# EAGLE schematic module_special_reg_ctrl (EAGLE 6.5.0)

## Sheet 1 of 12
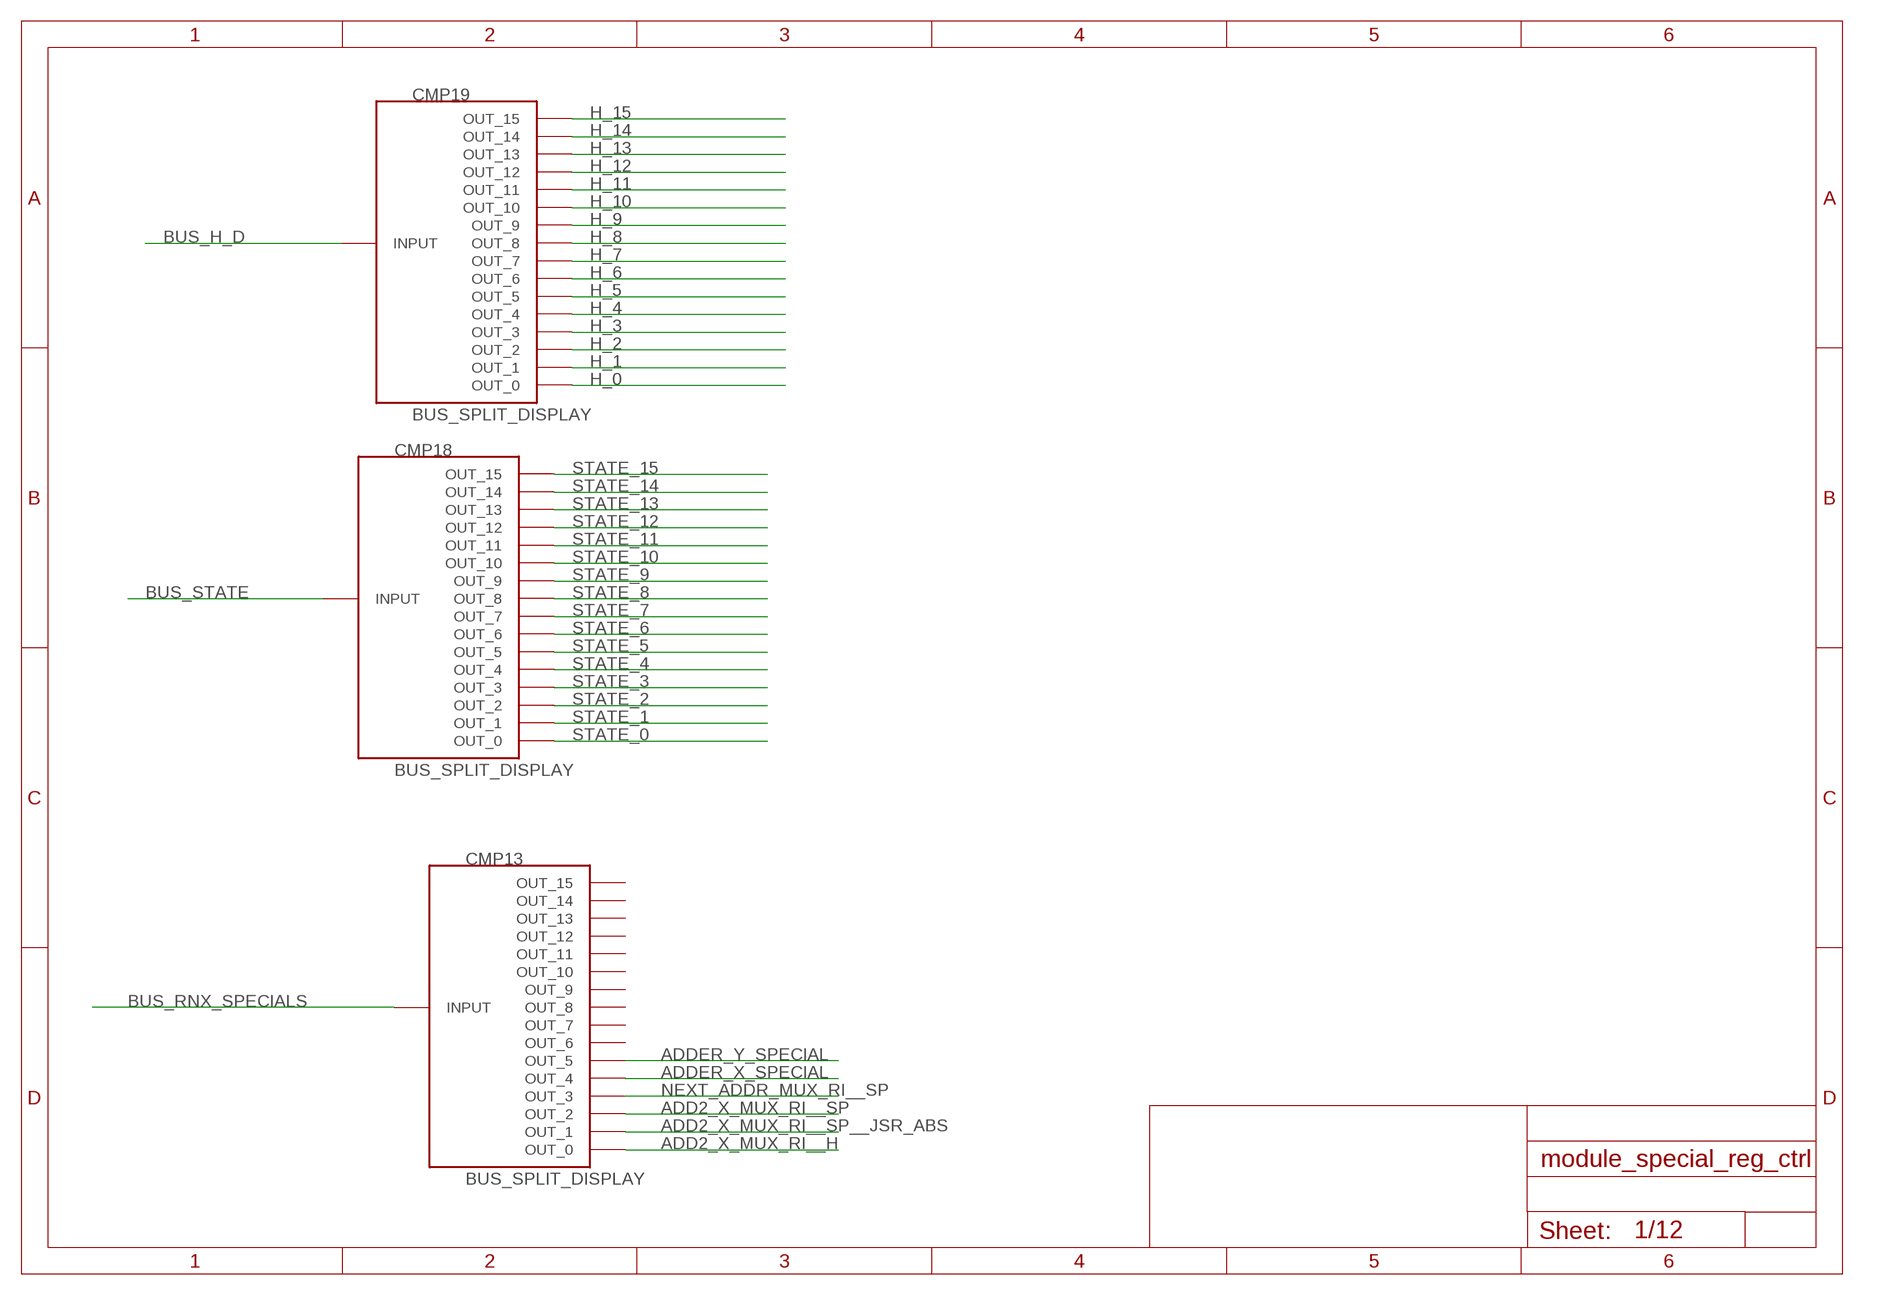
[diagram p0: schematic, sheet 1]

### Parts
CMP13  BUS_SPLIT_DISPLAY  [BUS_SPLIT_DISPLAY]
CMP18  BUS_SPLIT_DISPLAY  [BUS_SPLIT_DISPLAY]
CMP19  BUS_SPLIT_DISPLAY  [BUS_SPLIT_DISPLAY]

### Nets
ADD2_X_MUX_RI__H: CMP13.P$1(OUT_0)
ADD2_X_MUX_RI__SP: CMP13.P$3(OUT_2)
ADD2_X_MUX_RI__SP__JSR_ABS: CMP13.P$2(OUT_1) ; also sheet 9
ADDER_X_SPECIAL: CMP13.P$5(OUT_4)
ADDER_Y_SPECIAL: CMP13.P$6(OUT_5)
BUS_H_D: CMP19.INPUT
BUS_RNX_SPECIALS: CMP13.INPUT
BUS_STATE: CMP18.INPUT
H_0: CMP19.P$1(OUT_0) ; also sheet 4
H_1: CMP19.P$2(OUT_1) ; also sheet 4
H_2: CMP19.P$3(OUT_2) ; also sheet 4
H_3: CMP19.P$4(OUT_3) ; also sheet 4
H_4: CMP19.P$5(OUT_4) ; also sheet 7
H_5: CMP19.P$6(OUT_5) ; also sheet 6
H_6: CMP19.P$7(OUT_6)
H_7: CMP19.P$8(OUT_7)
H_8: CMP19.P$9(OUT_8)
H_9: CMP19.P$10(OUT_9)
H_10: CMP19.P$11(OUT_10)
H_11: CMP19.P$12(OUT_11)
H_12: CMP19.P$13(OUT_12)
H_13: CMP19.P$14(OUT_13)
H_14: CMP19.P$15(OUT_14)
H_15: CMP19.P$16(OUT_15)
NEXT_ADDR_MUX_RI__SP: CMP13.P$4(OUT_3) ; also sheet 10
STATE_0: CMP18.P$1(OUT_0) ; also sheet 4,5,6,7,8,9,10,11,12
STATE_1: CMP18.P$2(OUT_1) ; also sheet 4,5,6,8,9
STATE_2: CMP18.P$3(OUT_2) ; also sheet 4,6,7
STATE_3: CMP18.P$4(OUT_3)
STATE_4: CMP18.P$5(OUT_4) ; also sheet 4,5
STATE_5: CMP18.P$6(OUT_5) ; also sheet 8
STATE_6: CMP18.P$7(OUT_6) ; also sheet 4,9,11,12
STATE_7: CMP18.P$8(OUT_7) ; also sheet 4,12
STATE_8: CMP18.P$9(OUT_8) ; also sheet 7
STATE_9: CMP18.P$10(OUT_9) ; also sheet 12
STATE_10: CMP18.P$11(OUT_10) ; also sheet 6
STATE_11: CMP18.P$12(OUT_11) ; also sheet 6
STATE_12: CMP18.P$13(OUT_12) ; also sheet 6
STATE_13: CMP18.P$14(OUT_13) ; also sheet 5,6
STATE_14: CMP18.P$15(OUT_14)
STATE_15: CMP18.P$16(OUT_15) ; also sheet 7,9,12
Unconnected: CMP13.P$7(OUT_6) CMP13.P$8(OUT_7) CMP13.P$9(OUT_8) CMP13.P$10(OUT_9) CMP13.P$11(OUT_10) CMP13.P$12(OUT_11) CMP13.P$13(OUT_12) CMP13.P$14(OUT_13) CMP13.P$15(OUT_14) CMP13.P$16(OUT_15)

## Sheet 2 of 12
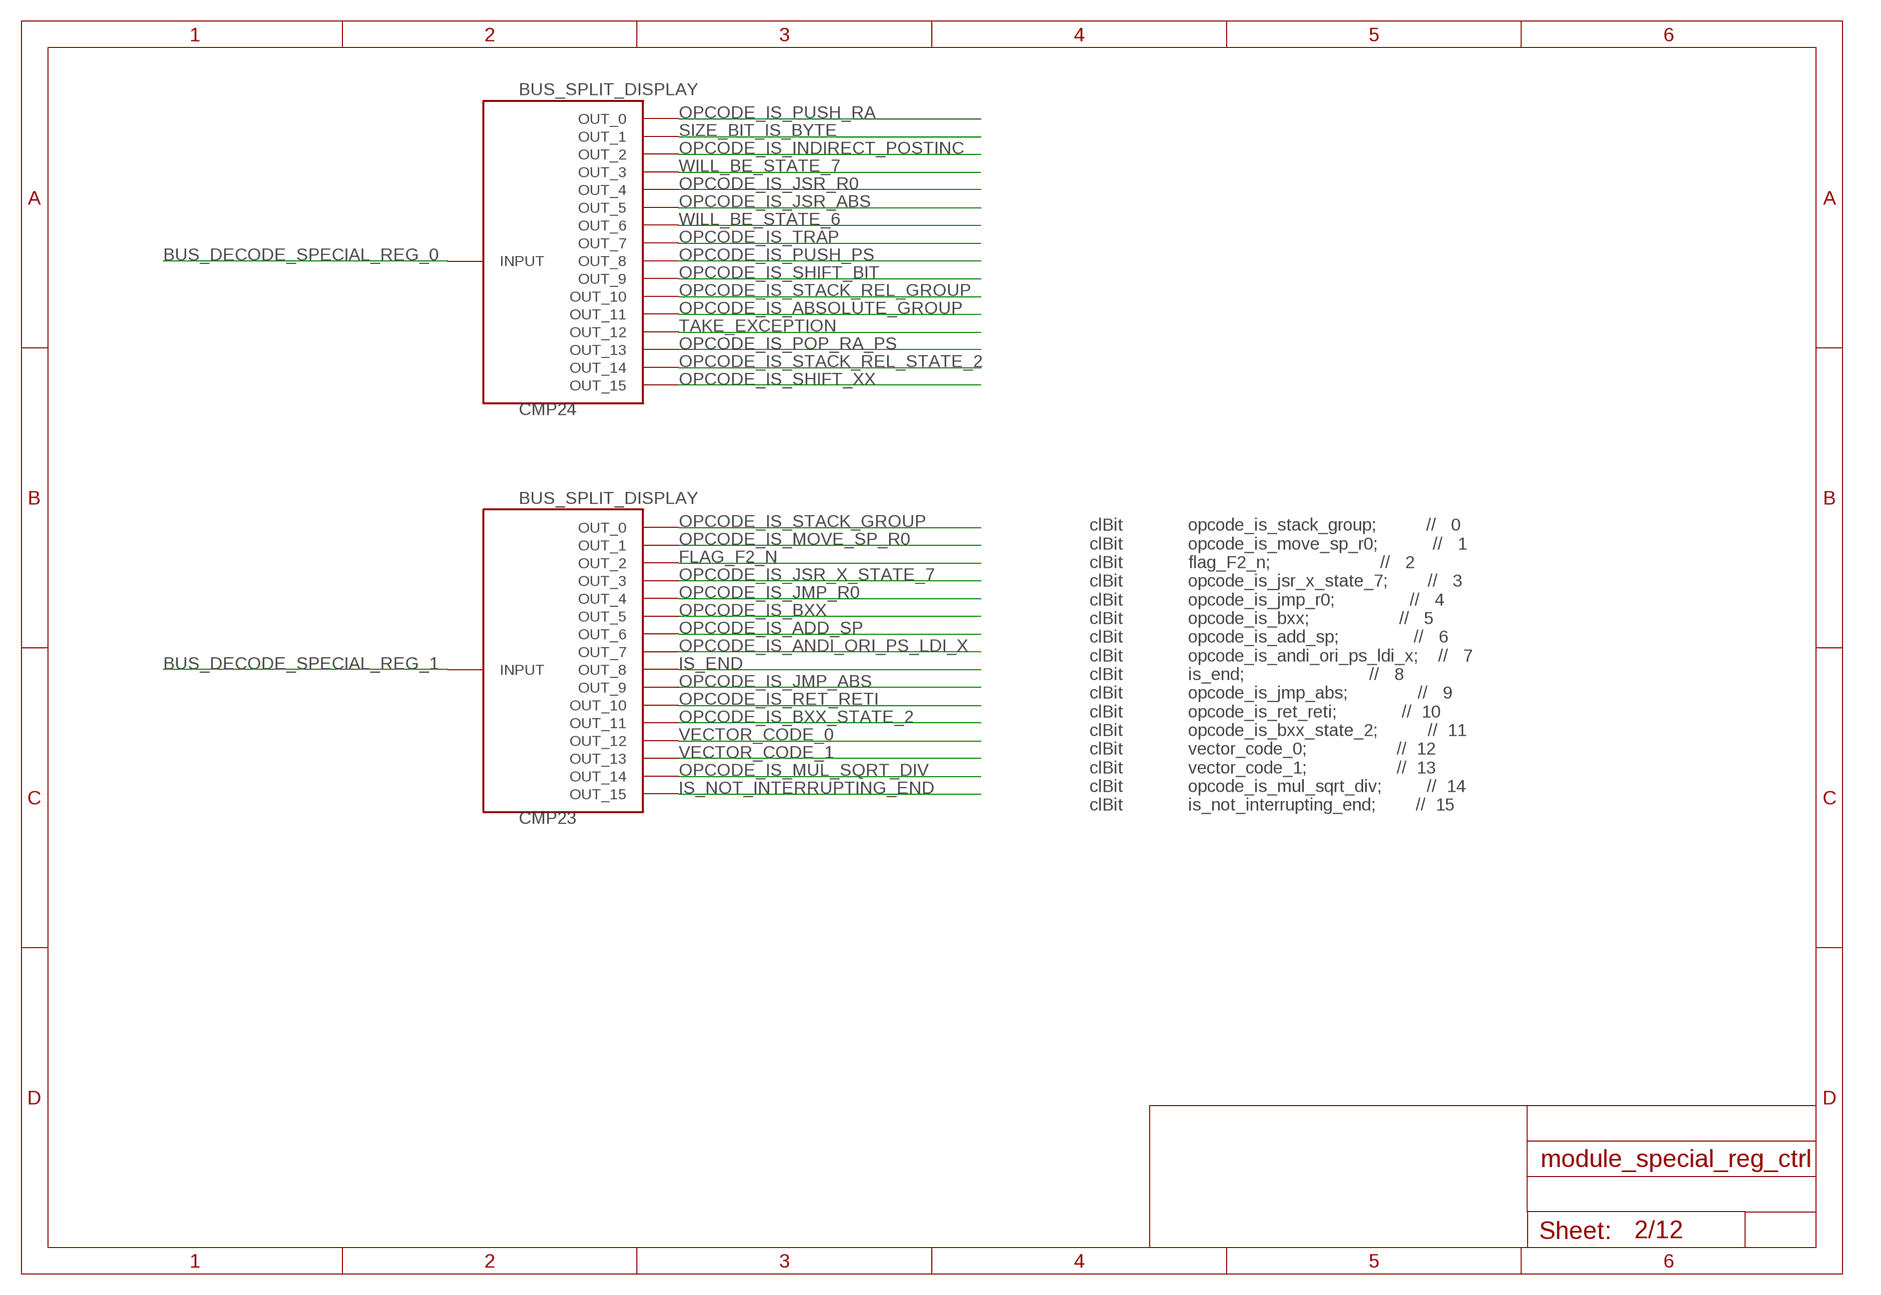
[diagram p1: schematic, sheet 2]

### Parts
CMP23  BUS_SPLIT_DISPLAY  [BUS_SPLIT_DISPLAY]
CMP24  BUS_SPLIT_DISPLAY  [BUS_SPLIT_DISPLAY]

### Nets
BUS_DECODE_SPECIAL_REG_0: CMP24.INPUT
BUS_DECODE_SPECIAL_REG_1: CMP23.INPUT
FLAG_F2_N: CMP23.P$3(OUT_2) ; also sheet 9
IS_END: CMP23.P$9(OUT_8) ; also sheet 9,10
IS_NOT_INTERRUPTING_END: CMP23.P$16(OUT_15) ; also sheet 8
OPCODE_IS_ABSOLUTE_GROUP: CMP24.P$12(OUT_11) ; also sheet 5,8,9
OPCODE_IS_ADD_SP: CMP23.P$7(OUT_6) ; also sheet 7,8
OPCODE_IS_ANDI_ORI_PS_LDI_X: CMP23.P$8(OUT_7) ; also sheet 8
OPCODE_IS_BXX: CMP23.P$6(OUT_5) ; also sheet 8
OPCODE_IS_BXX_STATE_2: CMP23.P$12(OUT_11) ; also sheet 8,9
OPCODE_IS_INDIRECT_POSTINC: CMP24.P$3(OUT_2) ; also sheet 5,6,10
OPCODE_IS_JMP_ABS: CMP23.P$10(OUT_9) ; also sheet 8
OPCODE_IS_JMP_R0: CMP23.P$5(OUT_4) ; also sheet 8
OPCODE_IS_JSR_ABS: CMP24.P$6(OUT_5) ; also sheet 5,8,11
OPCODE_IS_JSR_R0: CMP24.P$5(OUT_4) ; also sheet 7,9,11
OPCODE_IS_JSR_X_STATE_7: CMP23.P$4(OUT_3) ; also sheet 8
OPCODE_IS_MOVE_SP_R0: CMP23.P$2(OUT_1) ; also sheet 7
OPCODE_IS_MUL_SQRT_DIV: CMP23.P$15(OUT_14) ; also sheet 5,6
OPCODE_IS_POP_RA_PS: CMP24.P$14(OUT_13) ; also sheet 7,10
OPCODE_IS_PUSH_PS: CMP24.P$9(OUT_8) ; also sheet 7,9,10,11
OPCODE_IS_PUSH_RA: CMP24.P$1(OUT_0) ; also sheet 7,9,10,11,12
OPCODE_IS_RET_RETI: CMP23.P$11(OUT_10) ; also sheet 5,7,8
OPCODE_IS_SHIFT_BIT: CMP24.P$10(OUT_9) ; also sheet 6,8
OPCODE_IS_SHIFT_XX: CMP24.P$16(OUT_15) ; also sheet 4,6
OPCODE_IS_STACK_GROUP: CMP23.P$1(OUT_0) ; also sheet 7
OPCODE_IS_STACK_REL_GROUP: CMP24.P$11(OUT_10) ; also sheet 4,5,8,9,10
OPCODE_IS_STACK_REL_STATE_2: CMP24.P$15(OUT_14) ; also sheet 10
OPCODE_IS_TRAP: CMP24.P$8(OUT_7) ; also sheet 4,9,11
SIZE_BIT_IS_BYTE: CMP24.P$2(OUT_1) ; also sheet 11,12
TAKE_EXCEPTION: CMP24.P$13(OUT_12) ; also sheet 3,10
VECTOR_CODE_0: CMP23.P$13(OUT_12) ; also sheet 3
VECTOR_CODE_1: CMP23.P$14(OUT_13) ; also sheet 3
WILL_BE_STATE_6: CMP24.P$7(OUT_6) ; also sheet 11
WILL_BE_STATE_7: CMP24.P$4(OUT_3) ; also sheet 11,12

### Notes on the sheet
- clBit             opcode_is_stack_group;          //   0
      clBit             opcode_is_move_sp_r0;           //   1
      clBit             flag_F2_n;                      //   2
      clBit             opcode_is_jsr_x_state_7;        //   3
      clBit             opcode_is_jmp_r0;               //   4
      clBit             opcode_is_bxx;                  //   5
      clBit             opcode_is_add_sp;               //   6
      clBit             opcode_is_andi_ori_ps_ldi_x;    //   7
      clBit             is_end;                         //   8
      clBit             opcode_is_jmp_abs;              //   9
      clBit             opcode_is_ret_reti;             //  10
      clBit             opcode_is_bxx_state_2;          //  11
      clBit             vector_code_0;                  //  12
      clBit             vector_code_1;                  //  13
      clBit             opcode_is_mul_sqrt_div;         //  14
      clBit             is_not_interrupting_end;        //  15

## Sheet 3 of 12
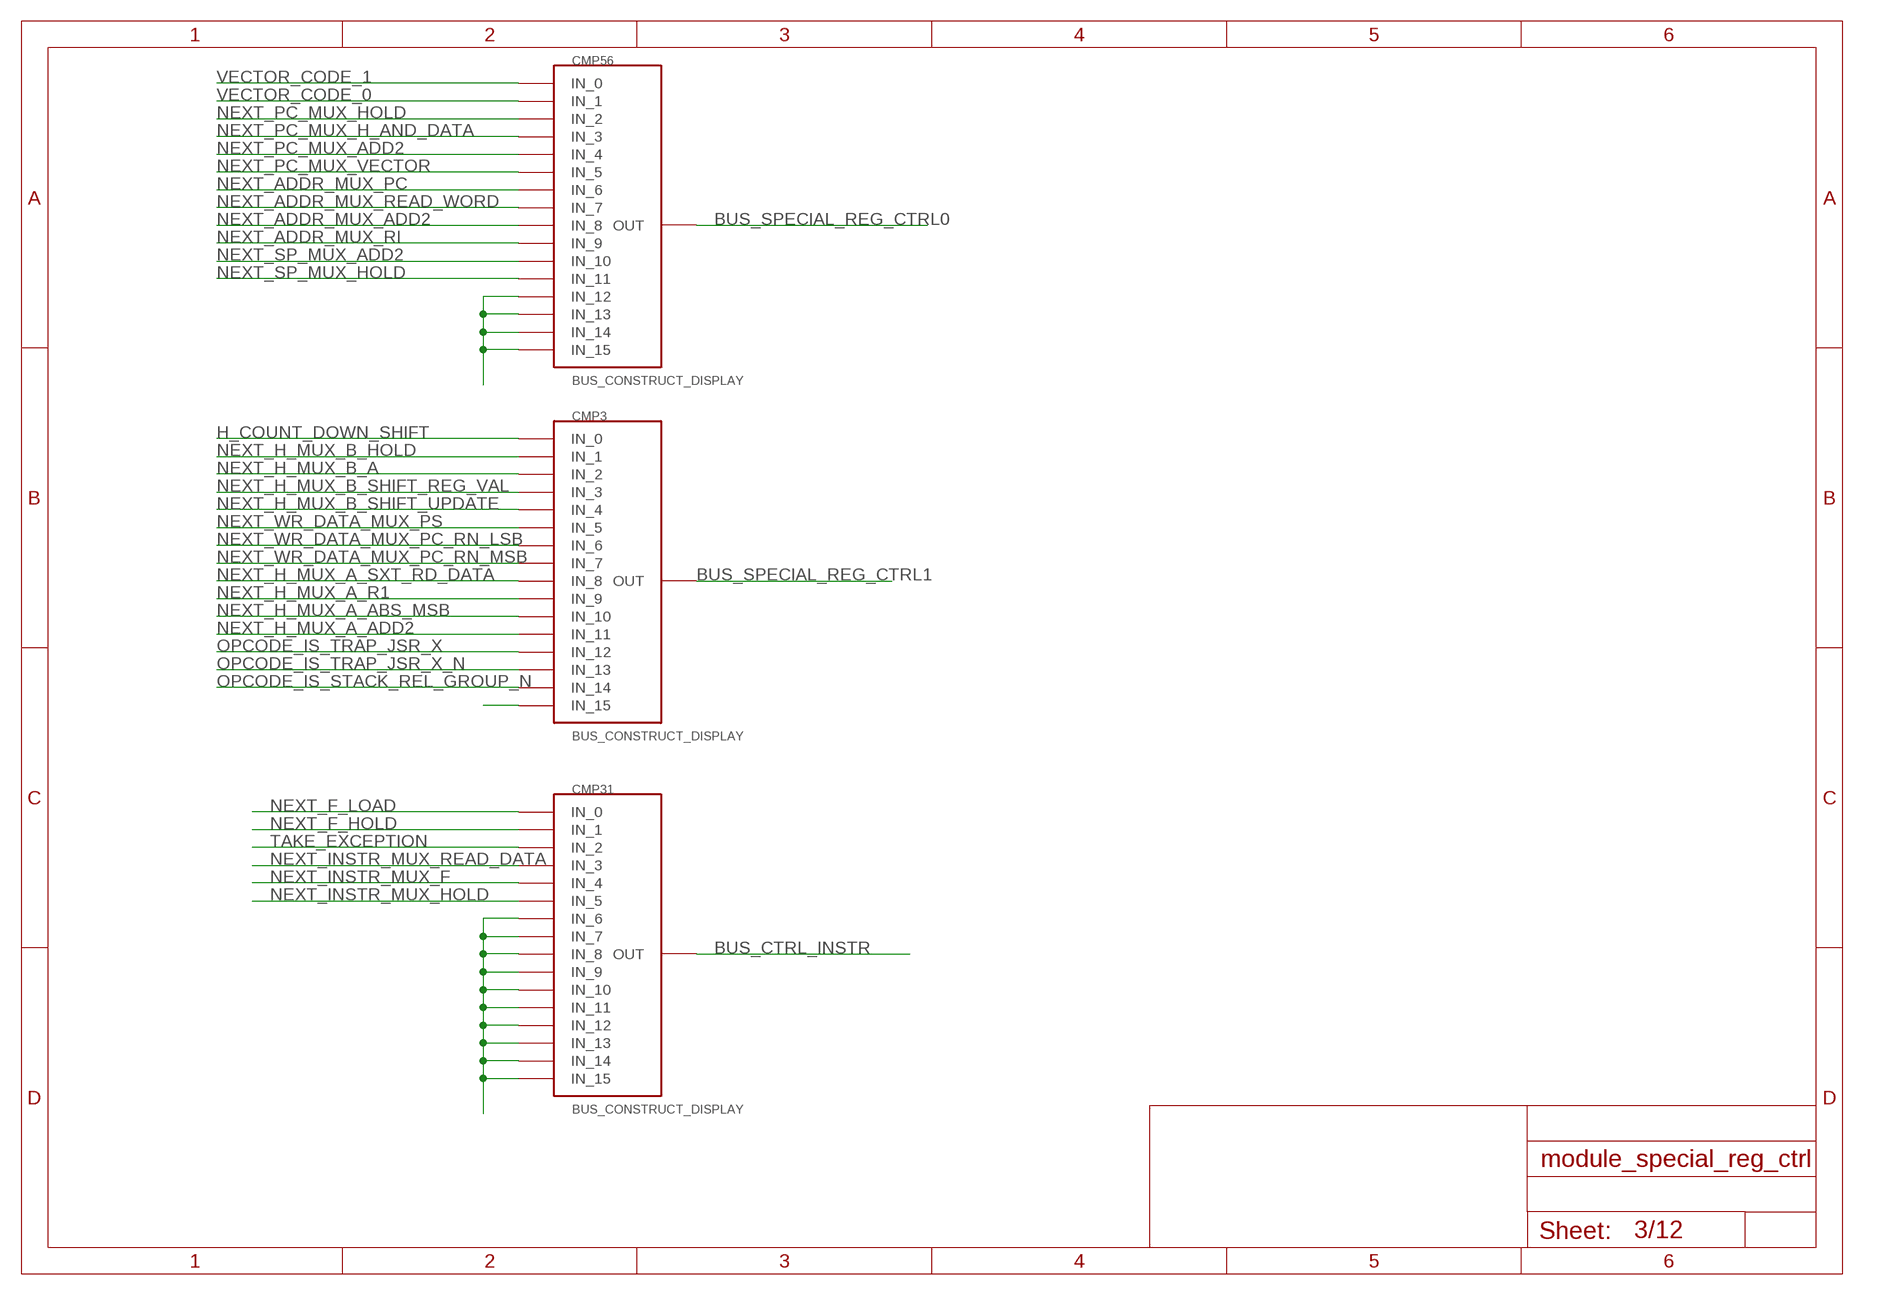
[diagram p2: schematic, sheet 3]

### Parts
CMP3  BUS_CONSTRUCT_DISPLAY  [BUS_SPLIT_DISPLAY]
CMP31  BUS_CONSTRUCT_DISPLAY  [BUS_SPLIT_DISPLAY]
CMP56  BUS_CONSTRUCT_DISPLAY  [BUS_SPLIT_DISPLAY]

### Nets
BUS_CTRL_INSTR: CMP31.INPUT(OUT)
BUS_SPECIAL_REG_CTRL0: CMP56.INPUT(OUT)
BUS_SPECIAL_REG_CTRL1: CMP3.INPUT(OUT)
H_COUNT_DOWN_SHIFT: CMP3.P$1(IN_0) ; also sheet 4
N$1: CMP56.P$13(IN_12) CMP56.P$14(IN_13) CMP56.P$15(IN_14) CMP56.P$16(IN_15)
N$3: CMP3.P$16(IN_15)
N$4: CMP31.P$7(IN_6) CMP31.P$8(IN_7) CMP31.P$9(IN_8) CMP31.P$10(IN_9) CMP31.P$11(IN_10) CMP31.P$12(IN_11) CMP31.P$13(IN_12) CMP31.P$14(IN_13) CMP31.P$15(IN_14) CMP31.P$16(IN_15)
NEXT_ADDR_MUX_ADD2: CMP56.P$9(IN_8) ; also sheet 9,10
NEXT_ADDR_MUX_PC: CMP56.P$7(IN_6) ; also sheet 10
NEXT_ADDR_MUX_READ_WORD: CMP56.P$8(IN_7) ; also sheet 9,10
NEXT_ADDR_MUX_RI: CMP56.P$10(IN_9) ; also sheet 10
NEXT_F_HOLD: CMP31.P$2(IN_1) ; also sheet 10
NEXT_F_LOAD: CMP31.P$1(IN_0) ; also sheet 10
NEXT_H_MUX_A_ABS_MSB: CMP3.P$11(IN_10) ; also sheet 5,6
NEXT_H_MUX_A_ADD2: CMP3.P$12(IN_11) ; also sheet 6
NEXT_H_MUX_A_R1: CMP3.P$10(IN_9) ; also sheet 5,6
NEXT_H_MUX_A_SXT_RD_DATA: CMP3.P$9(IN_8) ; also sheet 5,6
NEXT_H_MUX_B_A: CMP3.P$3(IN_2) ; also sheet 6,7
NEXT_H_MUX_B_HOLD: CMP3.P$2(IN_1) ; also sheet 7
NEXT_H_MUX_B_SHIFT_REG_VAL: CMP3.P$4(IN_3) ; also sheet 6,7
NEXT_H_MUX_B_SHIFT_UPDATE: CMP3.P$5(IN_4) ; also sheet 6,7
NEXT_INSTR_MUX_F: CMP31.P$5(IN_4) ; also sheet 10
NEXT_INSTR_MUX_HOLD: CMP31.P$6(IN_5) ; also sheet 10
NEXT_INSTR_MUX_READ_DATA: CMP31.P$4(IN_3) ; also sheet 10
NEXT_PC_MUX_ADD2: CMP56.P$5(IN_4) ; also sheet 8
NEXT_PC_MUX_H_AND_DATA: CMP56.P$4(IN_3) ; also sheet 8
NEXT_PC_MUX_HOLD: CMP56.P$3(IN_2) ; also sheet 8
NEXT_PC_MUX_VECTOR: CMP56.P$6(IN_5) ; also sheet 8
NEXT_SP_MUX_ADD2: CMP56.P$11(IN_10) ; also sheet 7
NEXT_SP_MUX_HOLD: CMP56.P$12(IN_11) ; also sheet 7
NEXT_WR_DATA_MUX_PC_RN_LSB: CMP3.P$7(IN_6) ; also sheet 11
NEXT_WR_DATA_MUX_PC_RN_MSB: CMP3.P$8(IN_7) ; also sheet 12
NEXT_WR_DATA_MUX_PS: CMP3.P$6(IN_5) ; also sheet 11,12
OPCODE_IS_STACK_REL_GROUP_N: CMP3.P$15(IN_14) ; also sheet 4
OPCODE_IS_TRAP_JSR_X: CMP3.P$13(IN_12) ; also sheet 11,12
OPCODE_IS_TRAP_JSR_X_N: CMP3.P$14(IN_13) ; also sheet 11
TAKE_EXCEPTION: CMP31.P$3(IN_2) ; also sheet 2,10
VECTOR_CODE_0: CMP56.P$2(IN_1) ; also sheet 2
VECTOR_CODE_1: CMP56.P$1(IN_0) ; also sheet 2

## Sheet 4 of 12
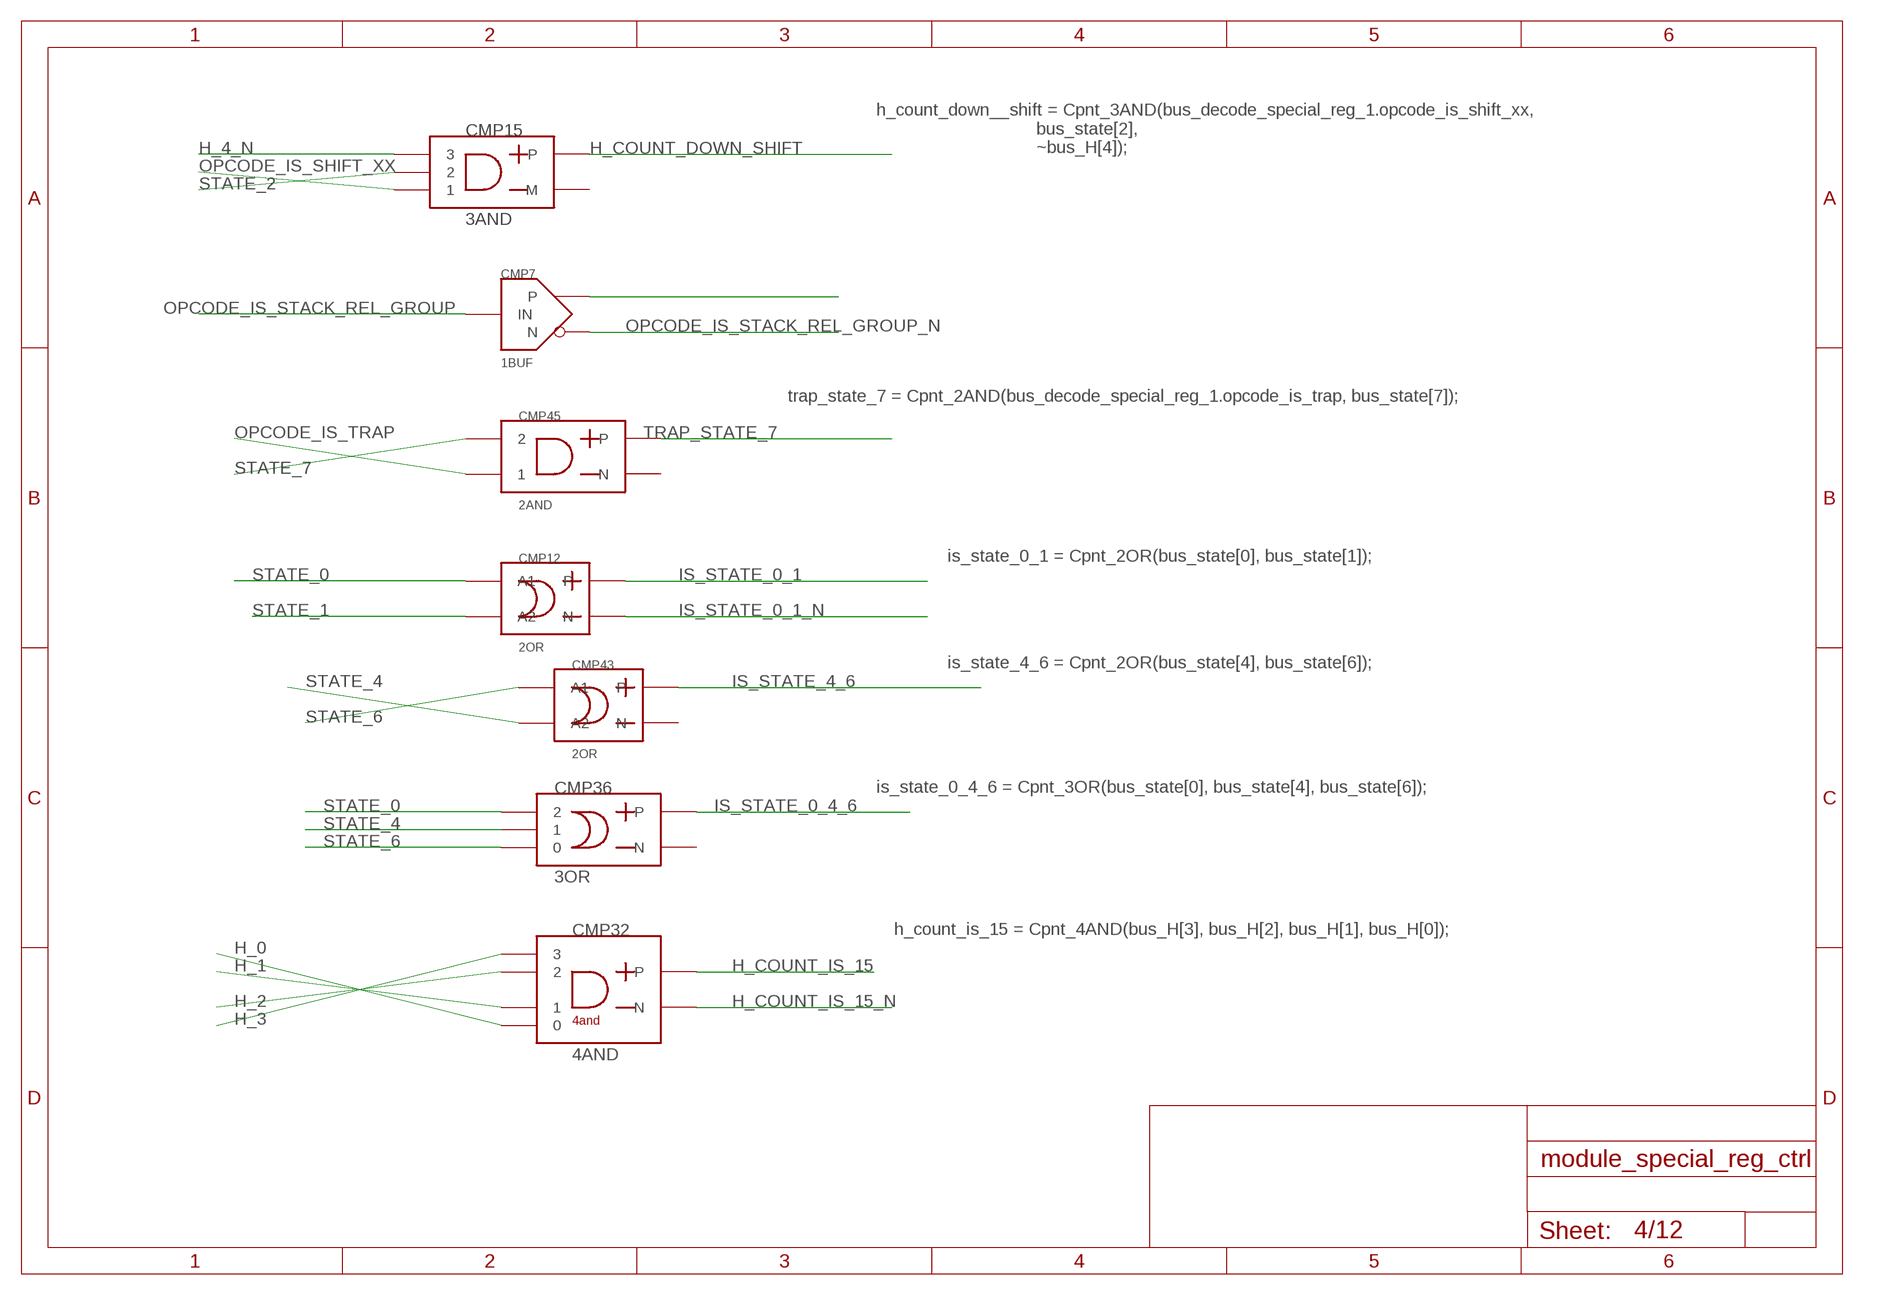
[diagram p3: schematic, sheet 4]

### Parts
CMP7  1BUF  [1BUF]
CMP12  2OR  [2OR]
CMP15  3AND  [3AND]
CMP32  4AND  [4AND]
CMP36  3OR  [3OR]
CMP43  2OR  [2OR]
CMP45  2AND  [2AND]

### Nets
H_0: CMP32.P$1 ; also sheet 1
H_1: CMP32.P$2 ; also sheet 1
H_2: CMP32.P$3 ; also sheet 1
H_3: CMP32.P$4 ; also sheet 1
H_4_N: CMP15.P$3 ; also sheet 7
H_COUNT_DOWN_SHIFT: CMP15.OUT_P(P) ; also sheet 3
H_COUNT_IS_15: CMP32.OUT_P(P) ; also sheet 5
H_COUNT_IS_15_N: CMP32.OUT_M(N) ; also sheet 6
IS_STATE_0_1: CMP12.OUT_P(P) ; also sheet 8
IS_STATE_0_1_N: CMP12.OUT_M(N) ; also sheet 5
IS_STATE_0_4_6: CMP36.OUT_P(P) ; also sheet 10
IS_STATE_4_6: CMP43.OUT_P(P) ; also sheet 7,9
N$8: CMP7.P
OPCODE_IS_SHIFT_XX: CMP15.P$1 ; also sheet 2,6
OPCODE_IS_STACK_REL_GROUP: CMP7.IN ; also sheet 2,5,8,9,10
OPCODE_IS_STACK_REL_GROUP_N: CMP7.N ; also sheet 3
OPCODE_IS_TRAP: CMP45.P$1 ; also sheet 2,9,11
STATE_0: CMP12.P$2(A1) CMP36.P$3 ; also sheet 1,5,6,7,8,9,10,11,12
STATE_1: CMP12.P$1(A2) ; also sheet 1,5,6,8,9
STATE_2: CMP15.P$2 ; also sheet 1,6,7
STATE_4: CMP36.P$2 CMP43.P$1(A2) ; also sheet 1,5
STATE_6: CMP36.P$1 CMP43.P$2(A1) ; also sheet 1,9,11,12
STATE_7: CMP45.P$2 ; also sheet 1,12
TRAP_STATE_7: CMP45.OUT_P(P) ; also sheet 7,8,9,11
Unconnected: CMP15.OUT_M(M) CMP36.OUT_M(N) CMP43.OUT_M(N) CMP45.OUT_M(N)

### Notes on the sheet
- h_count_down__shift = Cpnt_3AND(bus_decode_special_reg_1.opcode_is_shift_xx,
                                      bus_state[2],
                                      ~bus_H[4]);
- trap_state_7 = Cpnt_2AND(bus_decode_special_reg_1.opcode_is_trap, bus_state[7]);
- is_state_0_1 = Cpnt_2OR(bus_state[0], bus_state[1]);
- is_state_4_6 = Cpnt_2OR(bus_state[4], bus_state[6]);
- is_state_0_4_6 = Cpnt_3OR(bus_state[0], bus_state[4], bus_state[6]);
- h_count_is_15 = Cpnt_4AND(bus_H[3], bus_H[2], bus_H[1], bus_H[0]);

## Sheet 5 of 12
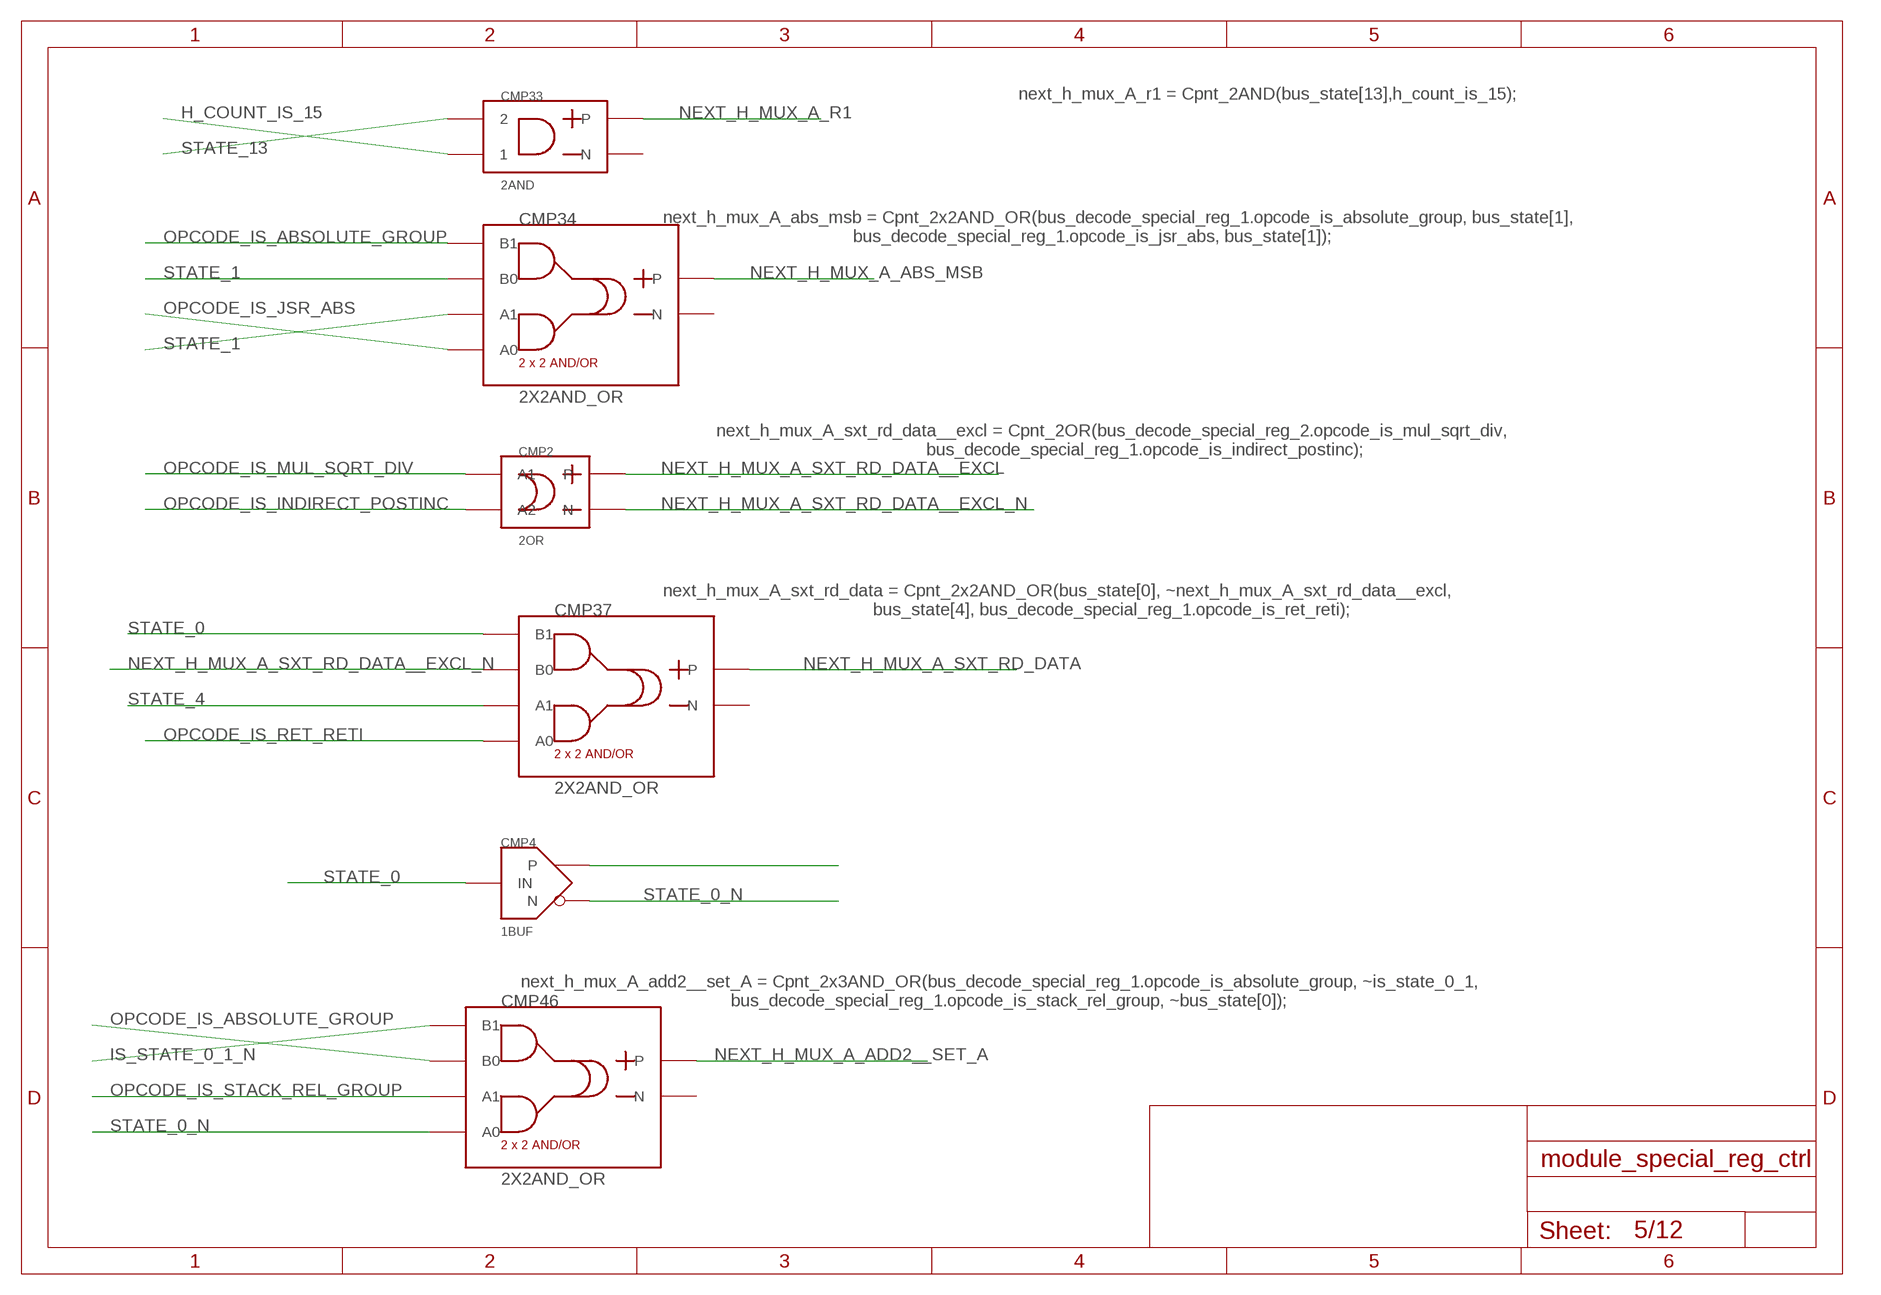
[diagram p4: schematic, sheet 5]

### Parts
CMP2  2OR  [2OR]
CMP4  1BUF  [1BUF]
CMP33  2AND  [2AND]
CMP34  2X2AND_OR  [2X2AND_OR]
CMP37  2X2AND_OR  [2X2AND_OR]
CMP46  2X2AND_OR  [2X2AND_OR]

### Nets
H_COUNT_IS_15: CMP33.P$1 ; also sheet 4
IS_STATE_0_1_N: CMP46.P$4(B1) ; also sheet 4
N$2: CMP4.P
NEXT_H_MUX_A_ABS_MSB: CMP34.OUT_P(P) ; also sheet 3,6
NEXT_H_MUX_A_ADD2__SET_A: CMP46.OUT_P(P) ; also sheet 6
NEXT_H_MUX_A_R1: CMP33.OUT_P(P) ; also sheet 3,6
NEXT_H_MUX_A_SXT_RD_DATA: CMP37.OUT_P(P) ; also sheet 3,6
NEXT_H_MUX_A_SXT_RD_DATA__EXCL: CMP2.OUT_P(P)
NEXT_H_MUX_A_SXT_RD_DATA__EXCL_N: CMP2.OUT_M(N) CMP37.P$3(B0)
OPCODE_IS_ABSOLUTE_GROUP: CMP34.P$4(B1) CMP46.P$3(B0) ; also sheet 2,8,9
OPCODE_IS_INDIRECT_POSTINC: CMP2.P$1(A2) ; also sheet 2,6,10
OPCODE_IS_JSR_ABS: CMP34.P$1(A0) ; also sheet 2,8,11
OPCODE_IS_MUL_SQRT_DIV: CMP2.P$2(A1) ; also sheet 2,6
OPCODE_IS_RET_RETI: CMP37.P$1(A0) ; also sheet 2,7,8
OPCODE_IS_STACK_REL_GROUP: CMP46.P$2(A1) ; also sheet 2,4,8,9,10
STATE_0: CMP4.IN CMP37.P$4(B1) ; also sheet 1,4,6,7,8,9,10,11,12
STATE_0_N: CMP4.N CMP46.P$1(A0)
STATE_1: CMP34.P$2(A1) CMP34.P$3(B0) ; also sheet 1,4,6,8,9
STATE_4: CMP37.P$2(A1) ; also sheet 1,4
STATE_13: CMP33.P$2 ; also sheet 1,6
Unconnected: CMP33.OUT_M(N) CMP34.OUT_M(N) CMP37.OUT_M(N) CMP46.OUT_M(N)

### Notes on the sheet
- next_h_mux_A_r1 = Cpnt_2AND(bus_state[13],h_count_is_15);
- next_h_mux_A_abs_msb = Cpnt_2x2AND_OR(bus_decode_special_reg_1.opcode_is_absolute_group, bus_state[1],
                                            bus_decode_special_reg_1.opcode_is_jsr_abs, bus_state[1]);
- next_h_mux_A_sxt_rd_data__excl = Cpnt_2OR(bus_decode_special_reg_2.opcode_is_mul_sqrt_div,
                                                bus_decode_special_reg_1.opcode_is_indirect_postinc);
- next_h_mux_A_sxt_rd_data = Cpnt_2x2AND_OR(bus_state[0], ~next_h_mux_A_sxt_rd_data__excl,
                                                bus_state[4], bus_decode_special_reg_1.opcode_is_ret_reti);
- next_h_mux_A_add2__set_A = Cpnt_2x3AND_OR(bus_decode_special_reg_1.opcode_is_absolute_group, ~is_state_0_1,
                                                bus_decode_special_reg_1.opcode_is_stack_rel_group, ~bus_state[0]);

## Sheet 6 of 12
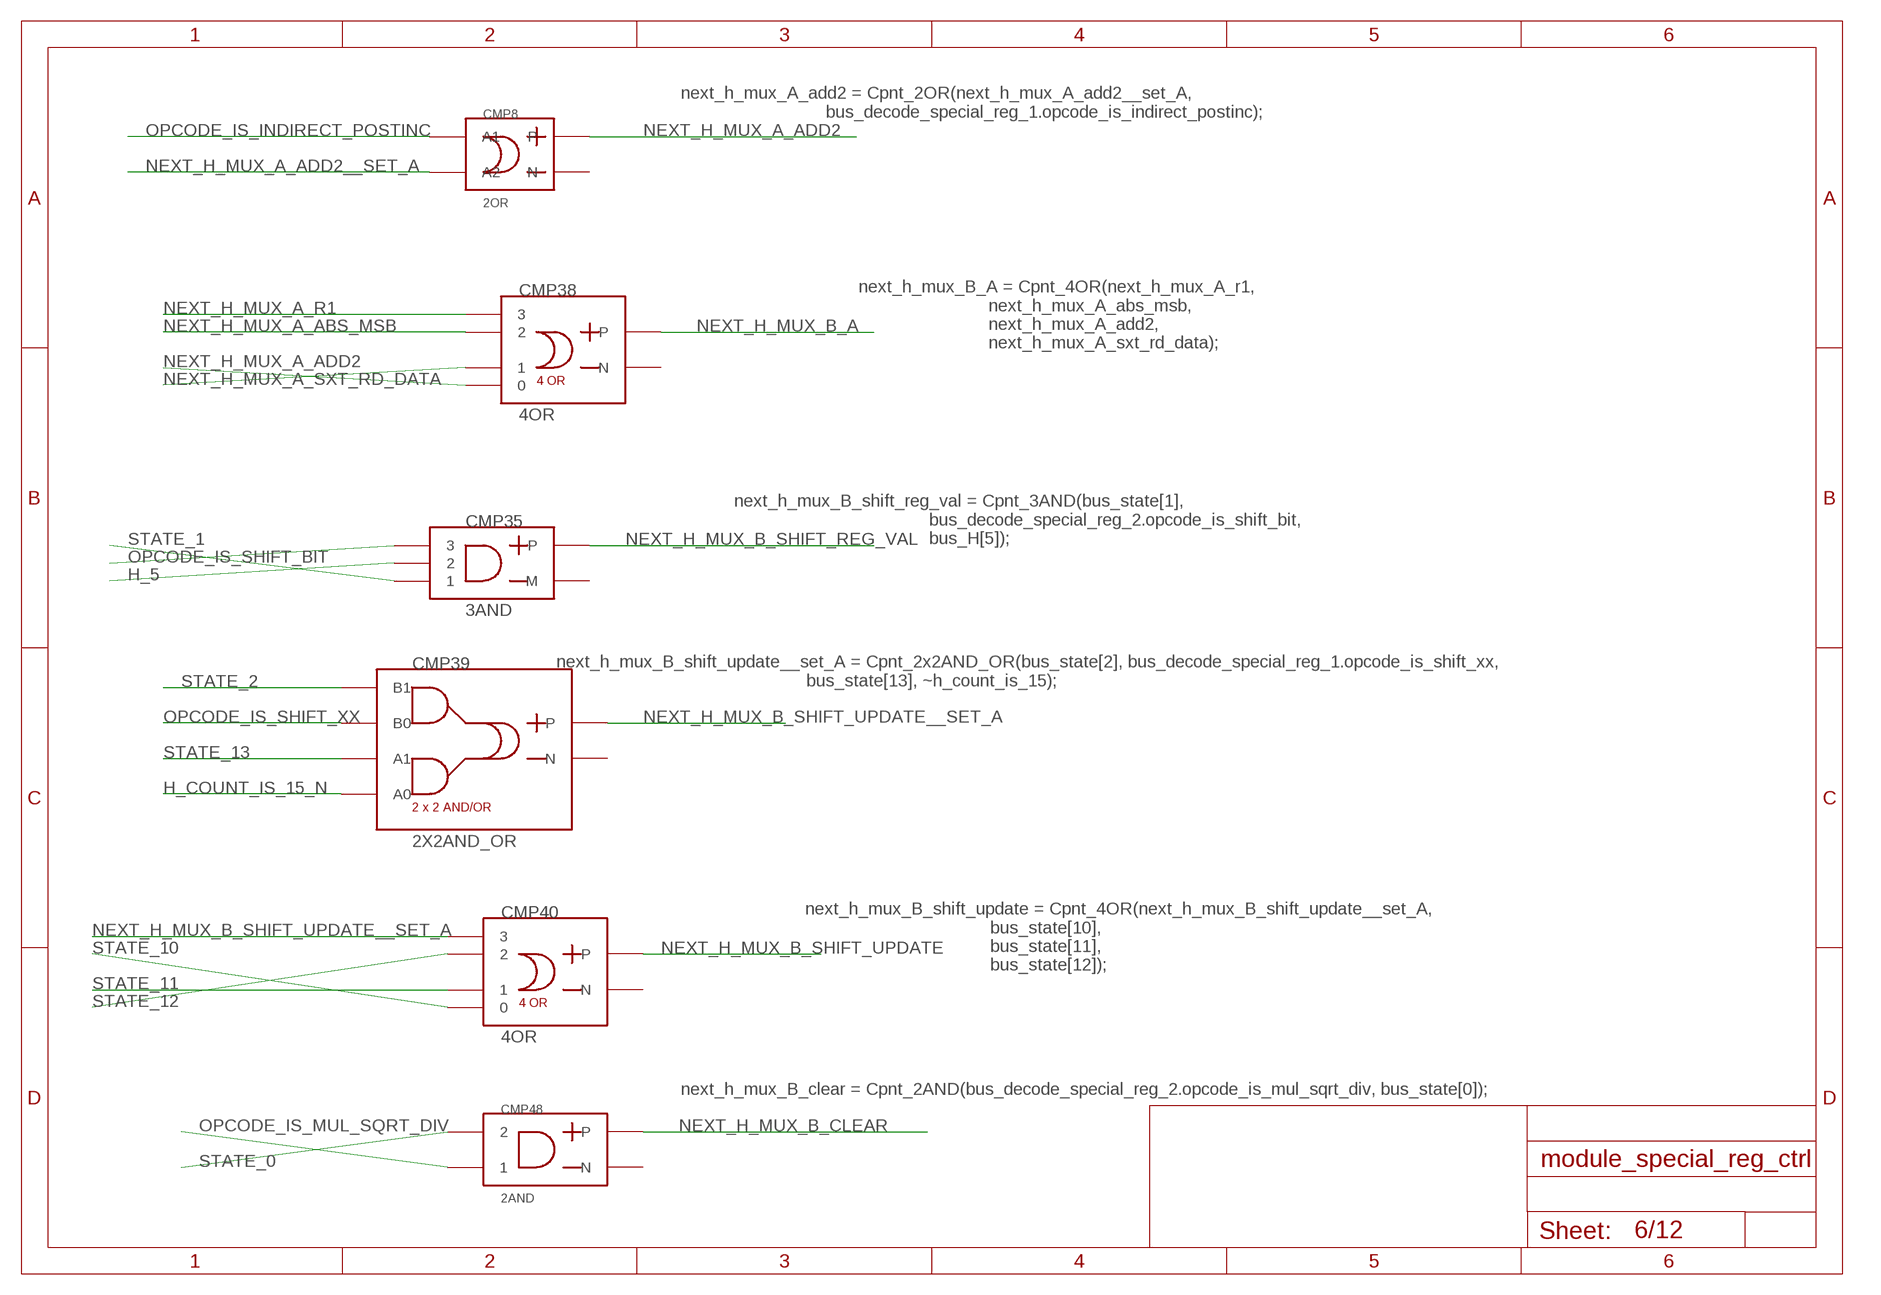
[diagram p5: schematic, sheet 6]

### Parts
CMP8  2OR  [2OR]
CMP35  3AND  [3AND]
CMP38  4OR  [4OR]
CMP39  2X2AND_OR  [2X2AND_OR]
CMP40  4OR  [4OR]
CMP48  2AND  [2AND]

### Nets
H_5: CMP35.P$2 ; also sheet 1
H_COUNT_IS_15_N: CMP39.P$1(A0) ; also sheet 4
NEXT_H_MUX_A_ABS_MSB: CMP38.3 ; also sheet 3,5
NEXT_H_MUX_A_ADD2: CMP8.OUT_P(P) CMP38.1 ; also sheet 3
NEXT_H_MUX_A_ADD2__SET_A: CMP8.P$1(A2) ; also sheet 5
NEXT_H_MUX_A_R1: CMP38.4 ; also sheet 3,5
NEXT_H_MUX_A_SXT_RD_DATA: CMP38.2 ; also sheet 3,5
NEXT_H_MUX_B_A: CMP38.OUT_P(P) ; also sheet 3,7
NEXT_H_MUX_B_CLEAR: CMP48.OUT_P(P) ; also sheet 7
NEXT_H_MUX_B_SHIFT_REG_VAL: CMP35.OUT_P(P) ; also sheet 3,7
NEXT_H_MUX_B_SHIFT_UPDATE: CMP40.OUT_P(P) ; also sheet 3,7
NEXT_H_MUX_B_SHIFT_UPDATE__SET_A: CMP39.OUT_P(P) CMP40.4
OPCODE_IS_INDIRECT_POSTINC: CMP8.P$2(A1) ; also sheet 2,5,10
OPCODE_IS_MUL_SQRT_DIV: CMP48.P$1 ; also sheet 2,5
OPCODE_IS_SHIFT_BIT: CMP35.P$3 ; also sheet 2,8
OPCODE_IS_SHIFT_XX: CMP39.P$3(B0) ; also sheet 2,4
STATE_0: CMP48.P$2 ; also sheet 1,4,5,7,8,9,10,11,12
STATE_1: CMP35.P$1 ; also sheet 1,4,5,8,9
STATE_2: CMP39.P$4(B1) ; also sheet 1,4,7
STATE_10: CMP40.1 ; also sheet 1
STATE_11: CMP40.2 ; also sheet 1
STATE_12: CMP40.3 ; also sheet 1
STATE_13: CMP39.P$2(A1) ; also sheet 1,5
Unconnected: CMP8.OUT_M(N) CMP35.OUT_M(M) CMP38.OUT_M(N) CMP39.OUT_M(N) CMP40.OUT_M(N) CMP48.OUT_M(N)

### Notes on the sheet
- next_h_mux_A_add2 = Cpnt_2OR(next_h_mux_A_add2__set_A,
                                   bus_decode_special_reg_1.opcode_is_indirect_postinc);
- next_h_mux_B_A = Cpnt_4OR(next_h_mux_A_r1,
                                next_h_mux_A_abs_msb,
                                next_h_mux_A_add2,
                                next_h_mux_A_sxt_rd_data);
- next_h_mux_B_shift_reg_val = Cpnt_3AND(bus_state[1],
                                             bus_decode_special_reg_2.opcode_is_shift_bit,
                                             bus_H[5]);
- next_h_mux_B_shift_update__set_A = Cpnt_2x2AND_OR(bus_state[2], bus_decode_special_reg_1.opcode_is_shift_xx,
                                                        bus_state[13], ~h_count_is_15);
- next_h_mux_B_shift_update = Cpnt_4OR(next_h_mux_B_shift_update__set_A,
                                           bus_state[10],
                                           bus_state[11],
                                           bus_state[12]);
- next_h_mux_B_clear = Cpnt_2AND(bus_decode_special_reg_2.opcode_is_mul_sqrt_div, bus_state[0]);

## Sheet 7 of 12
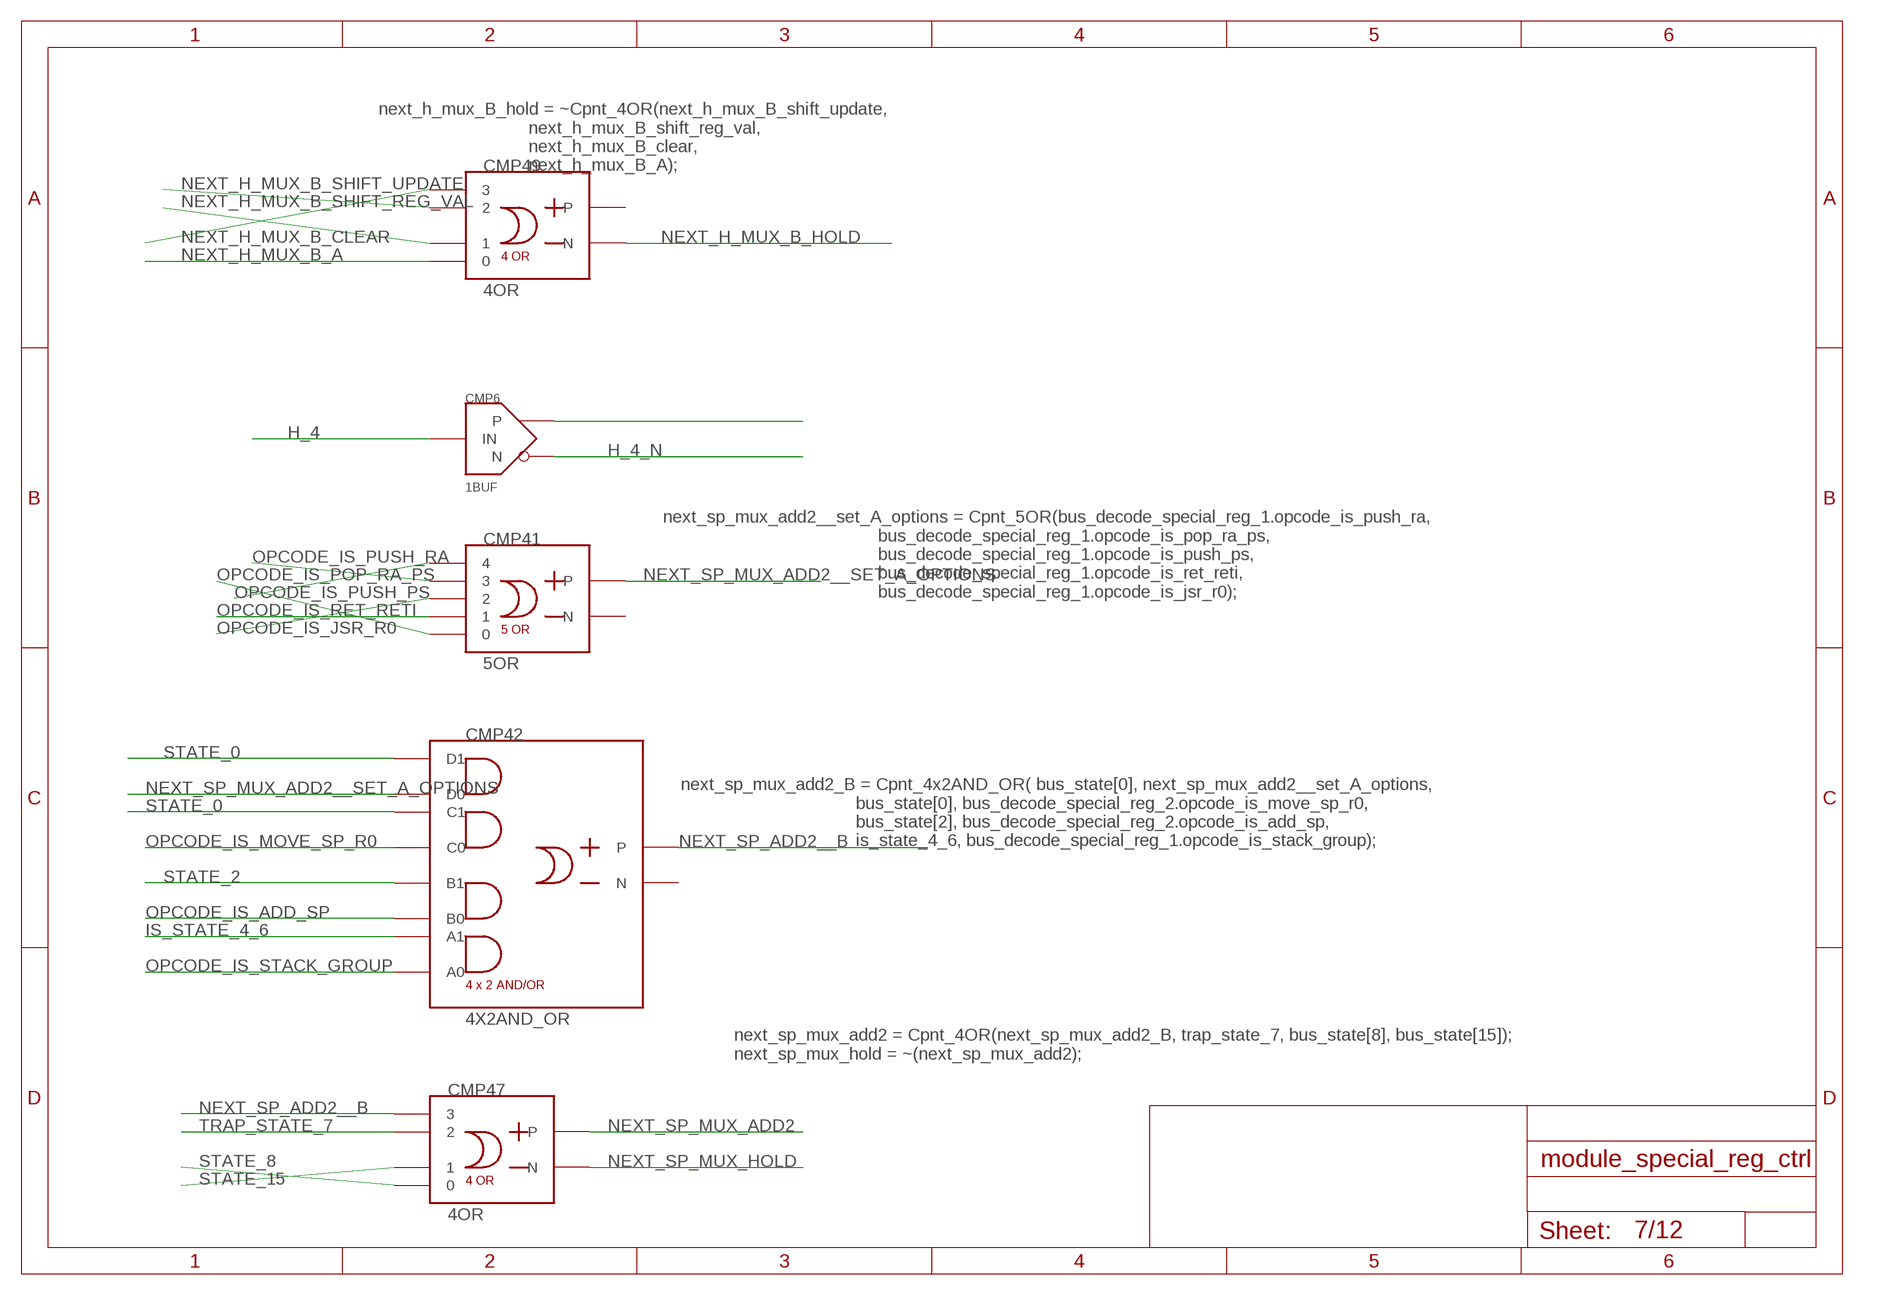
[diagram p6: schematic, sheet 7]

### Parts
CMP6  1BUF  [1BUF]
CMP41  5OR  [5OR]
CMP42  4X2AND_OR  [4X2AND_OR]
CMP47  4OR  [4OR]
CMP49  4OR  [4OR]

### Nets
H_4: CMP6.IN ; also sheet 1
H_4_N: CMP6.N ; also sheet 4
IS_STATE_4_6: CMP42.P$2(A1) ; also sheet 4,9
N$6: CMP6.P
NEXT_H_MUX_B_A: CMP49.1 ; also sheet 3,6
NEXT_H_MUX_B_CLEAR: CMP49.4 ; also sheet 6
NEXT_H_MUX_B_HOLD: CMP49.OUT_M(N) ; also sheet 3
NEXT_H_MUX_B_SHIFT_REG_VAL: CMP49.2 ; also sheet 3,6
NEXT_H_MUX_B_SHIFT_UPDATE: CMP49.3 ; also sheet 3,6
NEXT_SP_ADD2__B: CMP42.OUT_P(P) CMP47.4
NEXT_SP_MUX_ADD2: CMP47.OUT_P(P) ; also sheet 3
NEXT_SP_MUX_ADD2__SET_A_OPTIONS: CMP41.OUT_P(P) CMP42.P$7(D0)
NEXT_SP_MUX_HOLD: CMP47.OUT_M(N) ; also sheet 3
OPCODE_IS_ADD_SP: CMP42.P$3(B0) ; also sheet 2,8
OPCODE_IS_JSR_R0: CMP41.3 ; also sheet 2,9,11
OPCODE_IS_MOVE_SP_R0: CMP42.P$5(C0) ; also sheet 2
OPCODE_IS_POP_RA_PS: CMP41.1 ; also sheet 2,10
OPCODE_IS_PUSH_PS: CMP41.5 ; also sheet 2,9,10,11
OPCODE_IS_PUSH_RA: CMP41.4 ; also sheet 2,9,10,11,12
OPCODE_IS_RET_RETI: CMP41.2 ; also sheet 2,5,8
OPCODE_IS_STACK_GROUP: CMP42.P$1(A0) ; also sheet 2
STATE_0: CMP42.P$6(C1) CMP42.P$8(D1) ; also sheet 1,4,5,6,8,9,10,11,12
STATE_2: CMP42.P$4(B1) ; also sheet 1,4,6
STATE_8: CMP47.1 ; also sheet 1
STATE_15: CMP47.2 ; also sheet 1,9,12
TRAP_STATE_7: CMP47.3 ; also sheet 4,8,9,11
Unconnected: CMP41.OUT_M(N) CMP42.OUT_M(N) CMP49.OUT_P(P)

### Notes on the sheet
- next_h_mux_B_hold = ~Cpnt_4OR(next_h_mux_B_shift_update,
                                    next_h_mux_B_shift_reg_val,
                                    next_h_mux_B_clear,
                                    next_h_mux_B_A);
- next_sp_mux_add2__set_A_options = Cpnt_5OR(bus_decode_special_reg_1.opcode_is_push_ra,
                                                 bus_decode_special_reg_1.opcode_is_pop_ra_ps,
                                                 bus_decode_special_reg_1.opcode_is_push_ps,
                                                 bus_decode_special_reg_1.opcode_is_ret_reti,
                                                 bus_decode_special_reg_1.opcode_is_jsr_r0);
- next_sp_mux_add2_B = Cpnt_4x2AND_OR( bus_state[0], next_sp_mux_add2__set_A_options,
                                         bus_state[0], bus_decode_special_reg_2.opcode_is_move_sp_r0,
                                         bus_state[2], bus_decode_special_reg_2.opcode_is_add_sp,
                                         is_state_4_6, bus_decode_special_reg_1.opcode_is_stack_group);
- next_sp_mux_add2 = Cpnt_4OR(next_sp_mux_add2_B, trap_state_7, bus_state[8], bus_state[15]);
      next_sp_mux_hold = ~(next_sp_mux_add2);

## Sheet 8 of 12
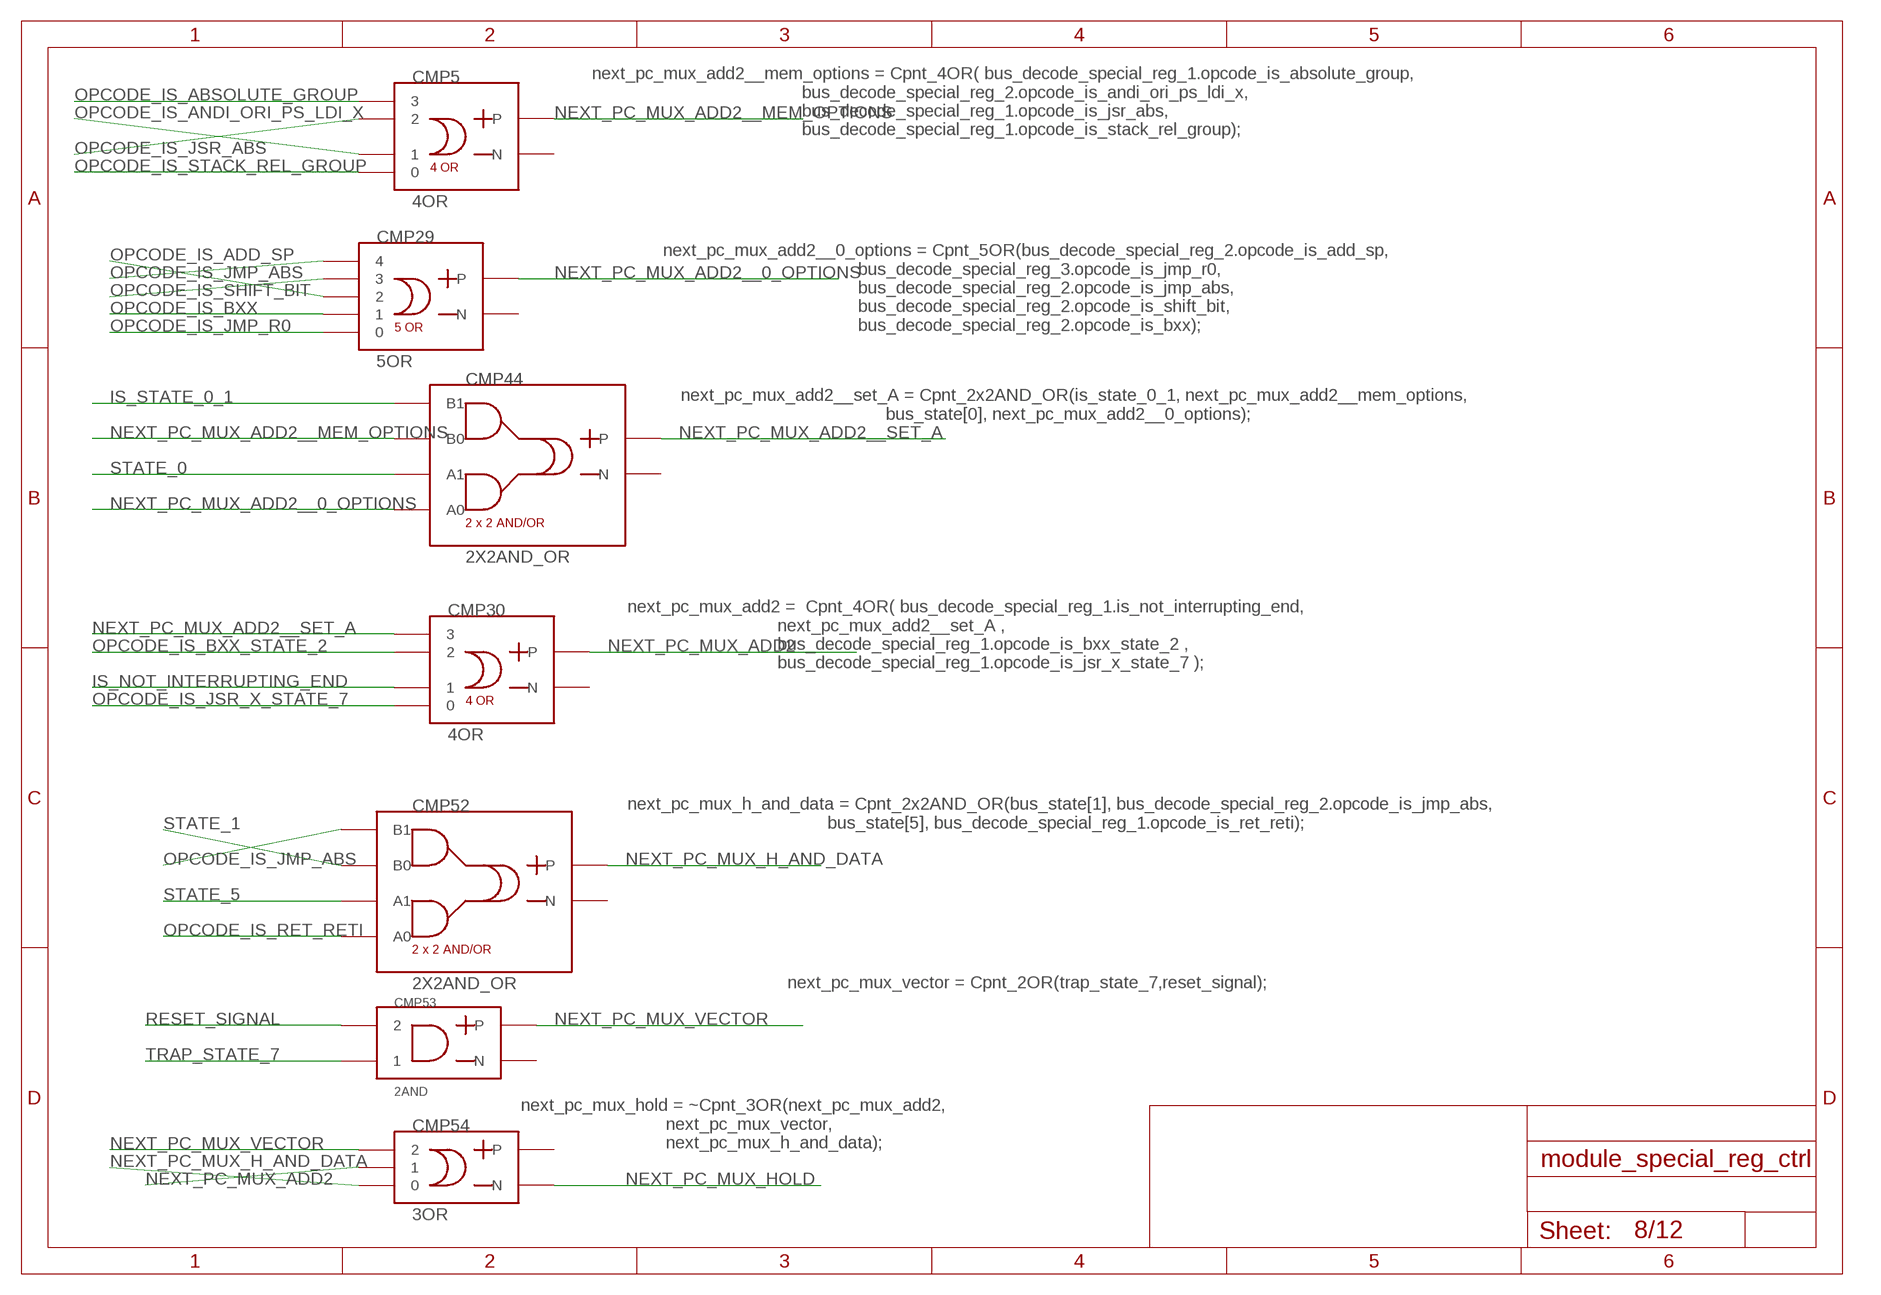
[diagram p7: schematic, sheet 8]

### Parts
CMP5  4OR  [4OR]
CMP29  5OR  [5OR]
CMP30  4OR  [4OR]
CMP44  2X2AND_OR  [2X2AND_OR]
CMP52  2X2AND_OR  [2X2AND_OR]
CMP53  2AND  [2AND]
CMP54  3OR  [3OR]

### Nets
IS_NOT_INTERRUPTING_END: CMP30.2 ; also sheet 2
IS_STATE_0_1: CMP44.P$4(B1) ; also sheet 4
NEXT_PC_MUX_ADD2: CMP30.OUT_P(P) CMP54.P$2 ; also sheet 3
NEXT_PC_MUX_ADD2__0_OPTIONS: CMP29.OUT_P(P) CMP44.P$1(A0)
NEXT_PC_MUX_ADD2__MEM_OPTIONS: CMP5.OUT_P(P) CMP44.P$3(B0)
NEXT_PC_MUX_ADD2__SET_A: CMP30.4 CMP44.OUT_P(P)
NEXT_PC_MUX_H_AND_DATA: CMP52.OUT_P(P) CMP54.P$1 ; also sheet 3
NEXT_PC_MUX_HOLD: CMP54.OUT_M(N) ; also sheet 3
NEXT_PC_MUX_VECTOR: CMP53.OUT_P(P) CMP54.P$3 ; also sheet 3
OPCODE_IS_ABSOLUTE_GROUP: CMP5.4 ; also sheet 2,5,9
OPCODE_IS_ADD_SP: CMP29.3 ; also sheet 2,7
OPCODE_IS_ANDI_ORI_PS_LDI_X: CMP5.2 ; also sheet 2
OPCODE_IS_BXX: CMP29.2 ; also sheet 2
OPCODE_IS_BXX_STATE_2: CMP30.3 ; also sheet 2,9
OPCODE_IS_JMP_ABS: CMP29.5 CMP52.P$4(B1) ; also sheet 2
OPCODE_IS_JMP_R0: CMP29.1 ; also sheet 2
OPCODE_IS_JSR_ABS: CMP5.3 ; also sheet 2,5,11
OPCODE_IS_JSR_X_STATE_7: CMP30.1 ; also sheet 2
OPCODE_IS_RET_RETI: CMP52.P$1(A0) ; also sheet 2,5,7
OPCODE_IS_SHIFT_BIT: CMP29.4 ; also sheet 2,6
OPCODE_IS_STACK_REL_GROUP: CMP5.1 ; also sheet 2,4,5,9,10
RESET_SIGNAL: CMP53.P$2
STATE_0: CMP44.P$2(A1) ; also sheet 1,4,5,6,7,9,10,11,12
STATE_1: CMP52.P$3(B0) ; also sheet 1,4,5,6,9
STATE_5: CMP52.P$2(A1) ; also sheet 1
TRAP_STATE_7: CMP53.P$1 ; also sheet 4,7,9,11
Unconnected: CMP5.OUT_M(N) CMP29.OUT_M(N) CMP30.OUT_M(N) CMP44.OUT_M(N) CMP52.OUT_M(N) CMP53.OUT_M(N) CMP54.OUT_P(P)

### Notes on the sheet
- next_pc_mux_add2__mem_options = Cpnt_4OR( bus_decode_special_reg_1.opcode_is_absolute_group,
                                                bus_decode_special_reg_2.opcode_is_andi_ori_ps_ldi_x,
                                                bus_decode_special_reg_1.opcode_is_jsr_abs,
                                                bus_decode_special_reg_1.opcode_is_stack_rel_group);
- next_pc_mux_add2__0_options = Cpnt_5OR(bus_decode_special_reg_2.opcode_is_add_sp,
                                             bus_decode_special_reg_3.opcode_is_jmp_r0,
                                             bus_decode_special_reg_2.opcode_is_jmp_abs,
                                             bus_decode_special_reg_2.opcode_is_shift_bit,
                                             bus_decode_special_reg_2.opcode_is_bxx);
- next_pc_mux_add2__set_A = Cpnt_2x2AND_OR(is_state_0_1, next_pc_mux_add2__mem_options,
                                               bus_state[0], next_pc_mux_add2__0_options);
- next_pc_mux_add2 =  Cpnt_4OR( bus_decode_special_reg_1.is_not_interrupting_end,
                                    next_pc_mux_add2__set_A ,
                                    bus_decode_special_reg_1.opcode_is_bxx_state_2 ,
                                    bus_decode_special_reg_1.opcode_is_jsr_x_state_7 );
- next_pc_mux_h_and_data = Cpnt_2x2AND_OR(bus_state[1], bus_decode_special_reg_2.opcode_is_jmp_abs,
                                              bus_state[5], bus_decode_special_reg_1.opcode_is_ret_reti);
- next_pc_mux_vector = Cpnt_2OR(trap_state_7,reset_signal);
- next_pc_mux_hold = ~Cpnt_3OR(next_pc_mux_add2,
                                   next_pc_mux_vector,
                                   next_pc_mux_h_and_data);

## Sheet 9 of 12
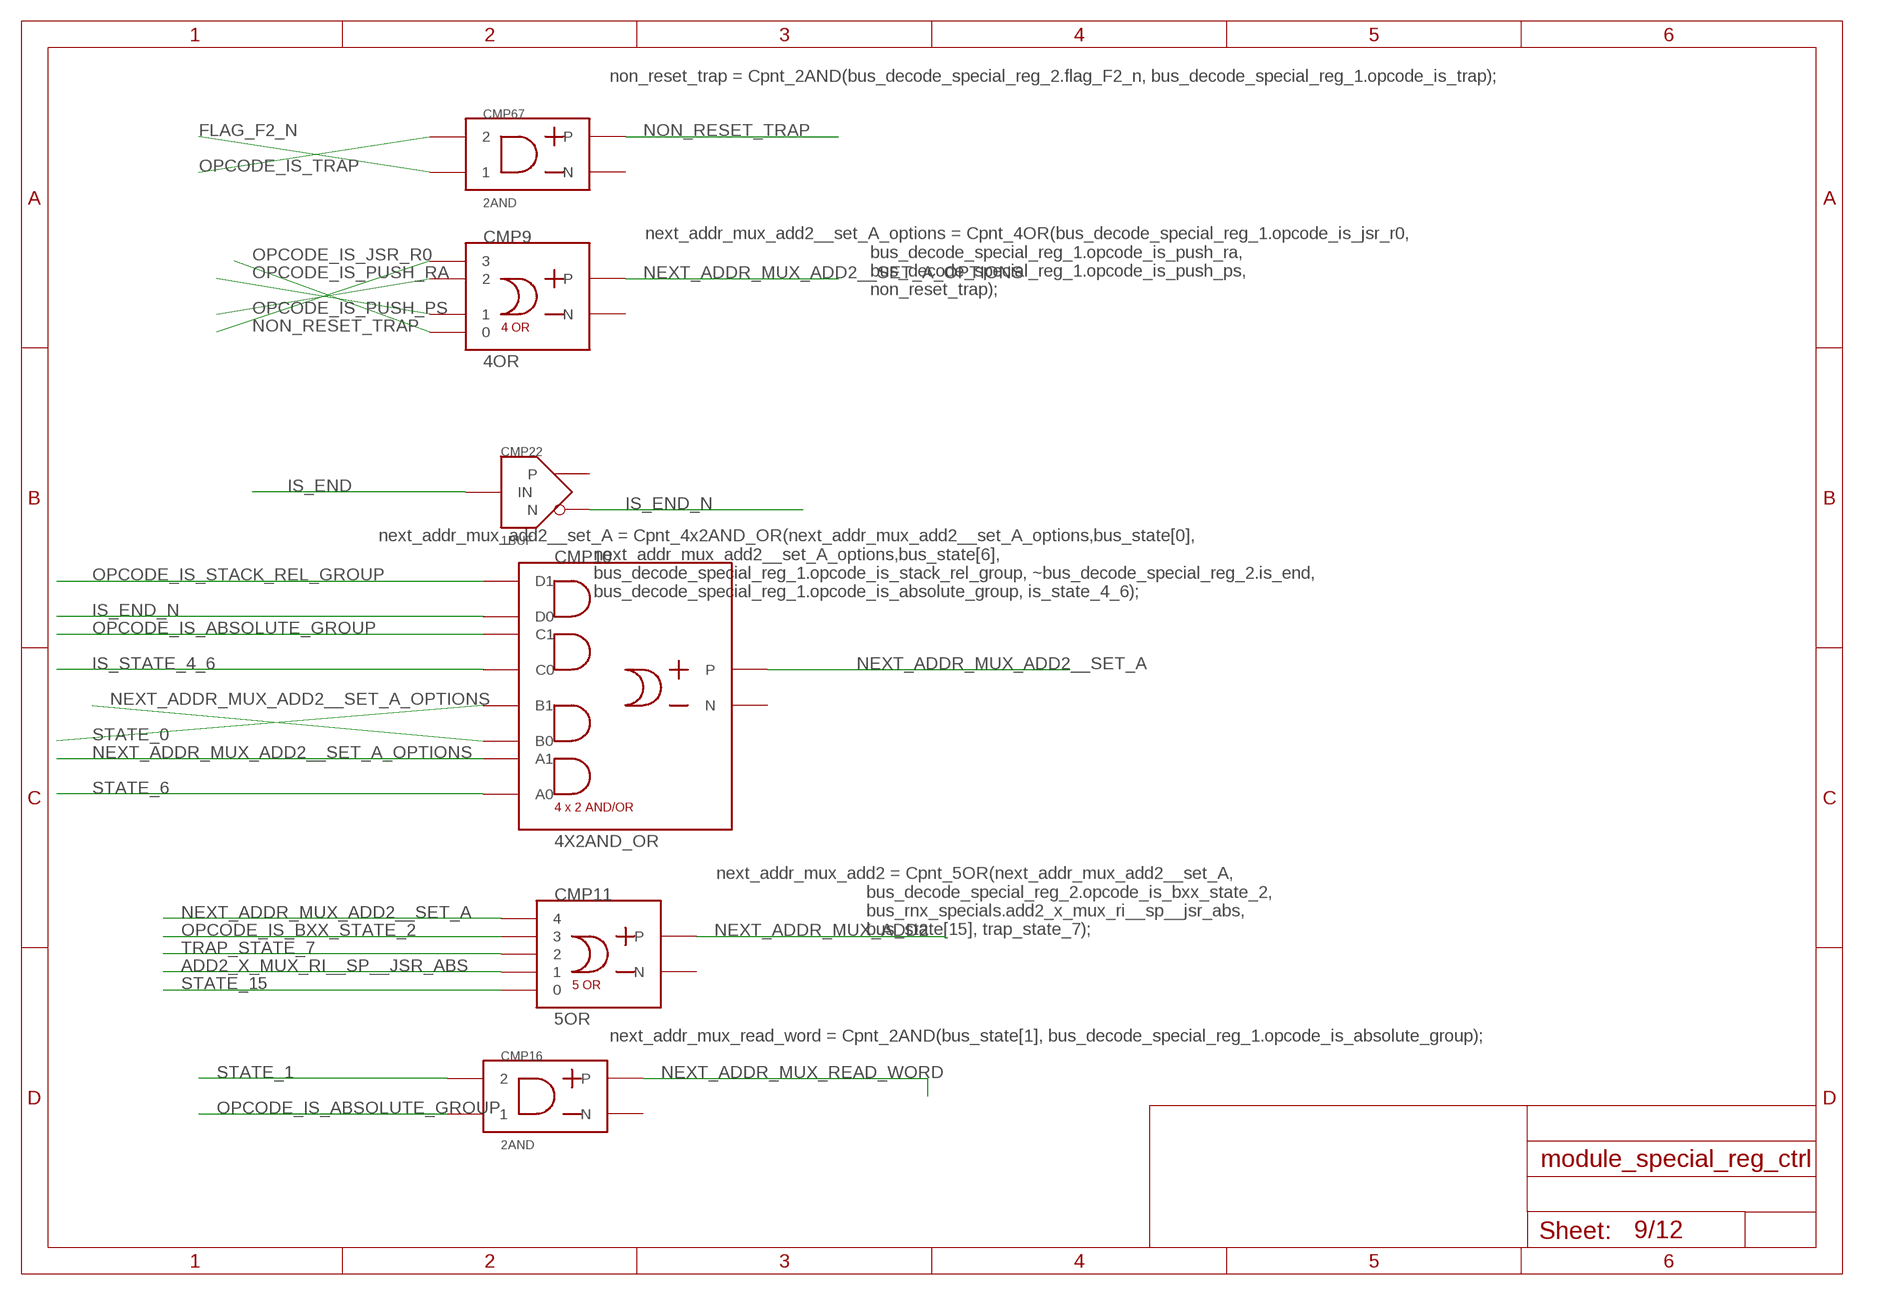
[diagram p8: schematic, sheet 9]

### Parts
CMP9  4OR  [4OR]
CMP10  4X2AND_OR  [4X2AND_OR]
CMP11  5OR  [5OR]
CMP16  2AND  [2AND]
CMP22  1BUF  [1BUF]
CMP67  2AND  [2AND]

### Nets
ADD2_X_MUX_RI__SP__JSR_ABS: CMP11.2 ; also sheet 1
FLAG_F2_N: CMP67.P$1 ; also sheet 2
IS_END: CMP22.IN ; also sheet 2,10
IS_END_N: CMP10.P$7(D0) CMP22.N
IS_STATE_4_6: CMP10.P$5(C0) ; also sheet 4,7
NEXT_ADDR_MUX_ADD2: CMP11.OUT_P(P) ; also sheet 3,10
NEXT_ADDR_MUX_ADD2__SET_A: CMP10.OUT_P(P) CMP11.5
NEXT_ADDR_MUX_ADD2__SET_A_OPTIONS: CMP9.OUT_P(P) CMP10.P$2(A1) CMP10.P$3(B0)
NEXT_ADDR_MUX_READ_WORD: CMP16.OUT_P(P) ; also sheet 3,10
NON_RESET_TRAP: CMP9.4 CMP67.OUT_P(P)
OPCODE_IS_ABSOLUTE_GROUP: CMP10.P$6(C1) CMP16.P$1 ; also sheet 2,5,8
OPCODE_IS_BXX_STATE_2: CMP11.4 ; also sheet 2,8
OPCODE_IS_JSR_R0: CMP9.1 ; also sheet 2,7,11
OPCODE_IS_PUSH_PS: CMP9.3 ; also sheet 2,7,10,11
OPCODE_IS_PUSH_RA: CMP9.2 ; also sheet 2,7,10,11,12
OPCODE_IS_STACK_REL_GROUP: CMP10.P$8(D1) ; also sheet 2,4,5,8,10
OPCODE_IS_TRAP: CMP67.P$2 ; also sheet 2,4,11
STATE_0: CMP10.P$4(B1) ; also sheet 1,4,5,6,7,8,10,11,12
STATE_1: CMP16.P$2 ; also sheet 1,4,5,6,8
STATE_6: CMP10.P$1(A0) ; also sheet 1,4,11,12
STATE_15: CMP11.1 ; also sheet 1,7,12
TRAP_STATE_7: CMP11.3 ; also sheet 4,7,8,11
Unconnected: CMP9.OUT_M(N) CMP10.OUT_M(N) CMP11.OUT_M(N) CMP16.OUT_M(N) CMP22.P CMP67.OUT_M(N)

### Notes on the sheet
- non_reset_trap = Cpnt_2AND(bus_decode_special_reg_2.flag_F2_n, bus_decode_special_reg_1.opcode_is_trap);
- next_addr_mux_add2__set_A_options = Cpnt_4OR(bus_decode_special_reg_1.opcode_is_jsr_r0,
                                                   bus_decode_special_reg_1.opcode_is_push_ra,
                                                   bus_decode_special_reg_1.opcode_is_push_ps,
                                                   non_reset_trap);
- next_addr_mux_add2__set_A = Cpnt_4x2AND_OR(next_addr_mux_add2__set_A_options,bus_state[0],
                                                 next_addr_mux_add2__set_A_options,bus_state[6],
                                                 bus_decode_special_reg_1.opcode_is_stack_rel_group, ~bus_decode_special_reg_2.is_end,
                                                 bus_decode_special_reg_1.opcode_is_absolute_group, is_state_4_6);
- next_addr_mux_add2 = Cpnt_5OR(next_addr_mux_add2__set_A,
                                    bus_decode_special_reg_2.opcode_is_bxx_state_2,
                                    bus_rnx_specials.add2_x_mux_ri__sp__jsr_abs,
                                    bus_state[15], trap_state_7);
- next_addr_mux_read_word = Cpnt_2AND(bus_state[1], bus_decode_special_reg_1.opcode_is_absolute_group);

## Sheet 10 of 12
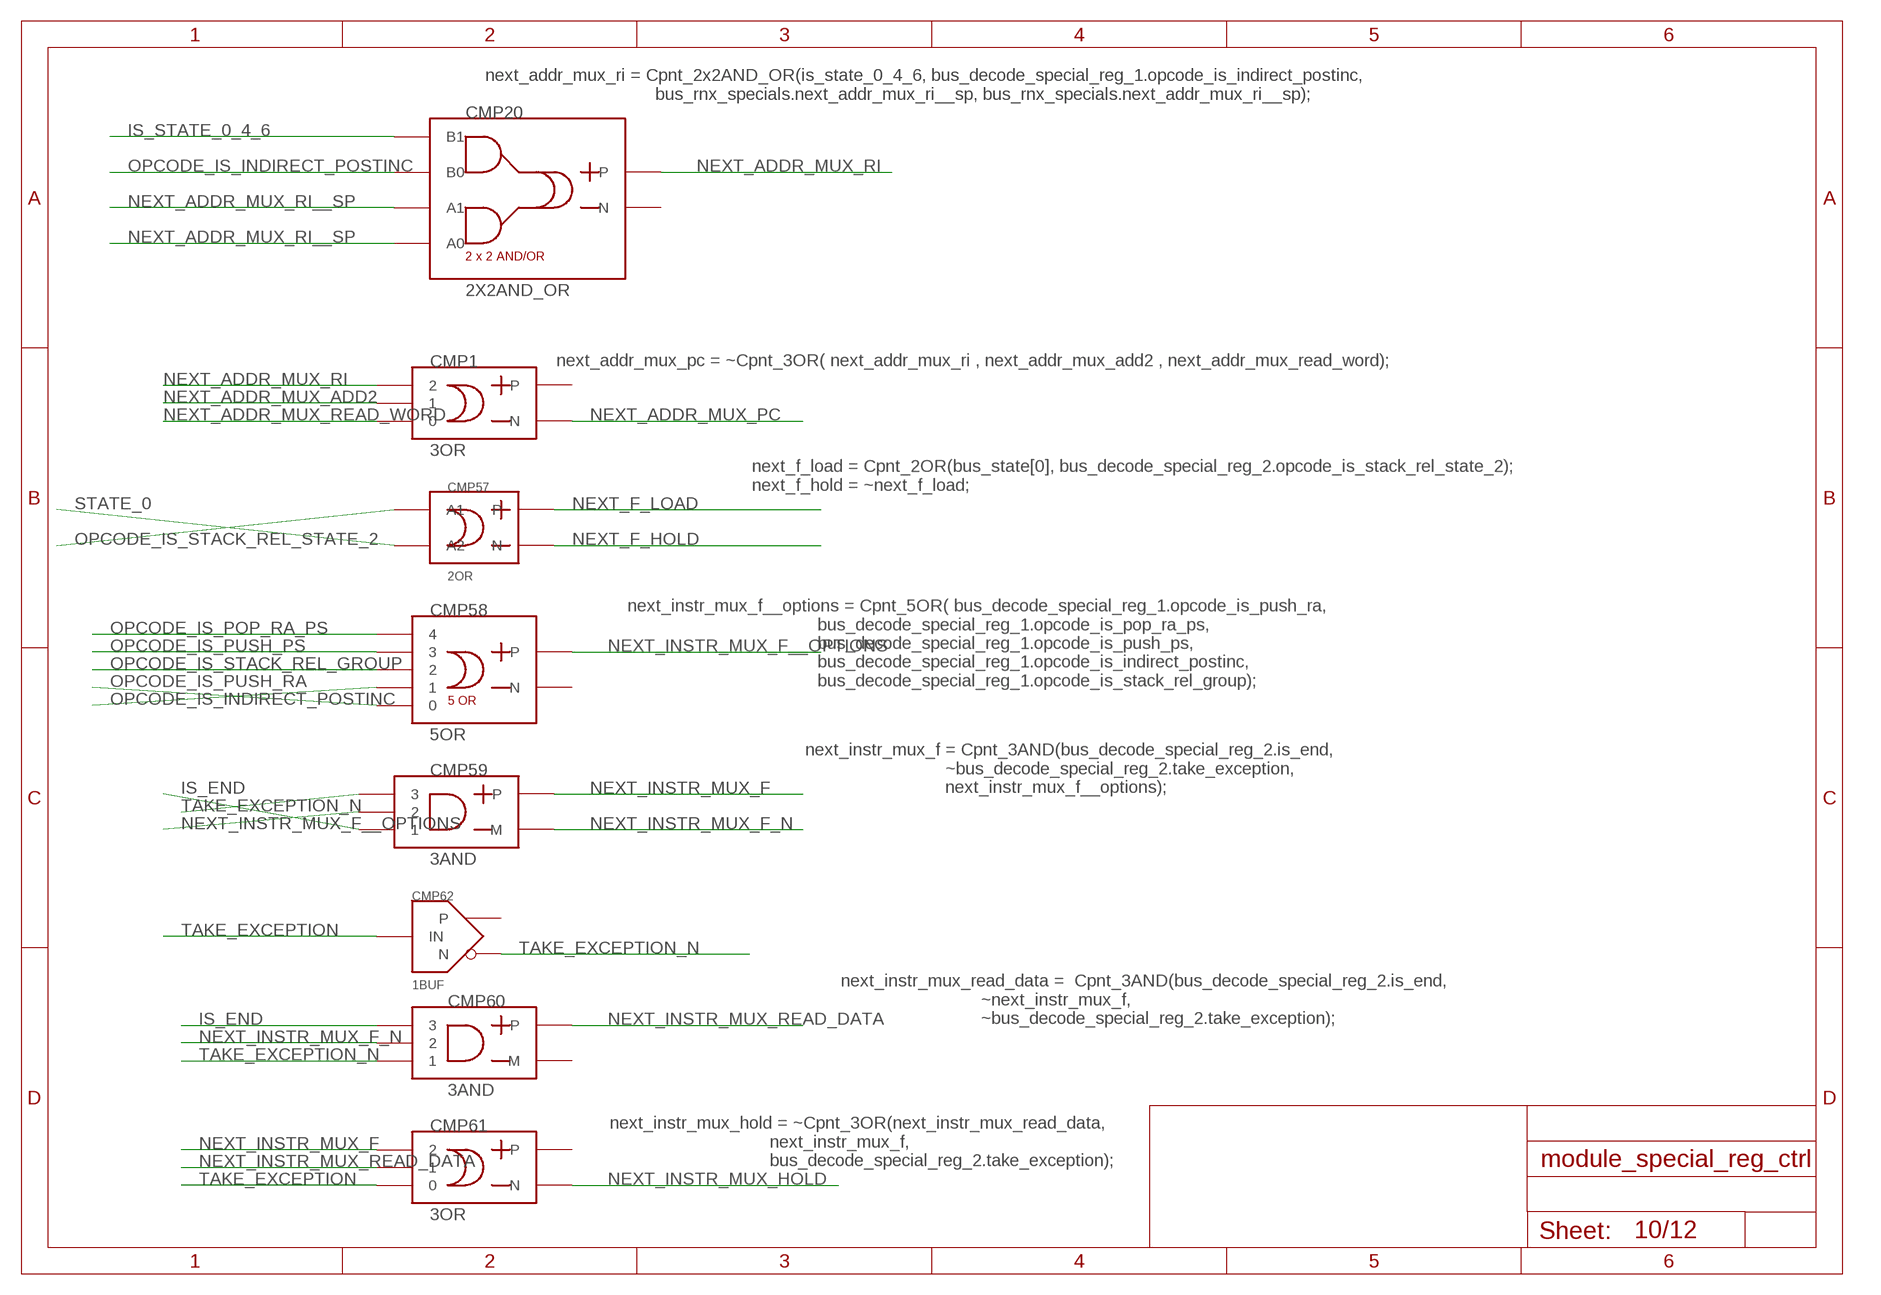
[diagram p9: schematic, sheet 10]

### Parts
CMP1  3OR  [3OR]
CMP20  2X2AND_OR  [2X2AND_OR]
CMP57  2OR  [2OR]
CMP58  5OR  [5OR]
CMP59  3AND  [3AND]
CMP60  3AND  [3AND]
CMP61  3OR  [3OR]
CMP62  1BUF  [1BUF]

### Nets
IS_END: CMP59.P$1 CMP60.P$3 ; also sheet 2,9
IS_STATE_0_4_6: CMP20.P$4(B1) ; also sheet 4
NEXT_ADDR_MUX_ADD2: CMP1.P$2 ; also sheet 3,9
NEXT_ADDR_MUX_PC: CMP1.OUT_M(N) ; also sheet 3
NEXT_ADDR_MUX_READ_WORD: CMP1.P$1 ; also sheet 3,9
NEXT_ADDR_MUX_RI: CMP1.P$3 CMP20.OUT_P(P) ; also sheet 3
NEXT_ADDR_MUX_RI__SP: CMP20.P$1(A0) CMP20.P$2(A1) ; also sheet 1
NEXT_F_HOLD: CMP57.OUT_M(N) ; also sheet 3
NEXT_F_LOAD: CMP57.OUT_P(P) ; also sheet 3
NEXT_INSTR_MUX_F: CMP59.OUT_P(P) CMP61.P$3 ; also sheet 3
NEXT_INSTR_MUX_F__OPTIONS: CMP58.OUT_P(P) CMP59.P$2
NEXT_INSTR_MUX_F_N: CMP59.OUT_M(M) CMP60.P$2
NEXT_INSTR_MUX_HOLD: CMP61.OUT_M(N) ; also sheet 3
NEXT_INSTR_MUX_READ_DATA: CMP60.OUT_P(P) CMP61.P$2 ; also sheet 3
OPCODE_IS_INDIRECT_POSTINC: CMP20.P$3(B0) CMP58.2 ; also sheet 2,5,6
OPCODE_IS_POP_RA_PS: CMP58.5 ; also sheet 2,7
OPCODE_IS_PUSH_PS: CMP58.4 ; also sheet 2,7,9,11
OPCODE_IS_PUSH_RA: CMP58.1 ; also sheet 2,7,9,11,12
OPCODE_IS_STACK_REL_GROUP: CMP58.3 ; also sheet 2,4,5,8,9
OPCODE_IS_STACK_REL_STATE_2: CMP57.P$2(A1) ; also sheet 2
STATE_0: CMP57.P$1(A2) ; also sheet 1,4,5,6,7,8,9,11,12
TAKE_EXCEPTION: CMP61.P$1 CMP62.IN ; also sheet 2,3
TAKE_EXCEPTION_N: CMP59.P$3 CMP60.P$1 CMP62.N
Unconnected: CMP1.OUT_P(P) CMP20.OUT_M(N) CMP58.OUT_M(N) CMP60.OUT_M(M) CMP61.OUT_P(P) CMP62.P

### Notes on the sheet
- next_addr_mux_ri = Cpnt_2x2AND_OR(is_state_0_4_6, bus_decode_special_reg_1.opcode_is_indirect_postinc,
                                        bus_rnx_specials.next_addr_mux_ri__sp, bus_rnx_specials.next_addr_mux_ri__sp);
- next_addr_mux_pc = ~Cpnt_3OR( next_addr_mux_ri , next_addr_mux_add2 , next_addr_mux_read_word);
- next_f_load = Cpnt_2OR(bus_state[0], bus_decode_special_reg_2.opcode_is_stack_rel_state_2);
      next_f_hold = ~next_f_load;
- next_instr_mux_f__options = Cpnt_5OR( bus_decode_special_reg_1.opcode_is_push_ra,
                                            bus_decode_special_reg_1.opcode_is_pop_ra_ps,
                                            bus_decode_special_reg_1.opcode_is_push_ps,
                                            bus_decode_special_reg_1.opcode_is_indirect_postinc,
                                            bus_decode_special_reg_1.opcode_is_stack_rel_group);
- next_instr_mux_f = Cpnt_3AND(bus_decode_special_reg_2.is_end,
                                  ~bus_decode_special_reg_2.take_exception,
                                  next_instr_mux_f__options);
- next_instr_mux_read_data =  Cpnt_3AND(bus_decode_special_reg_2.is_end,
                                  ~next_instr_mux_f,
                                  ~bus_decode_special_reg_2.take_exception);
- next_instr_mux_hold = ~Cpnt_3OR(next_instr_mux_read_data,
                                      next_instr_mux_f,
                                      bus_decode_special_reg_2.take_exception);

## Sheet 11 of 12
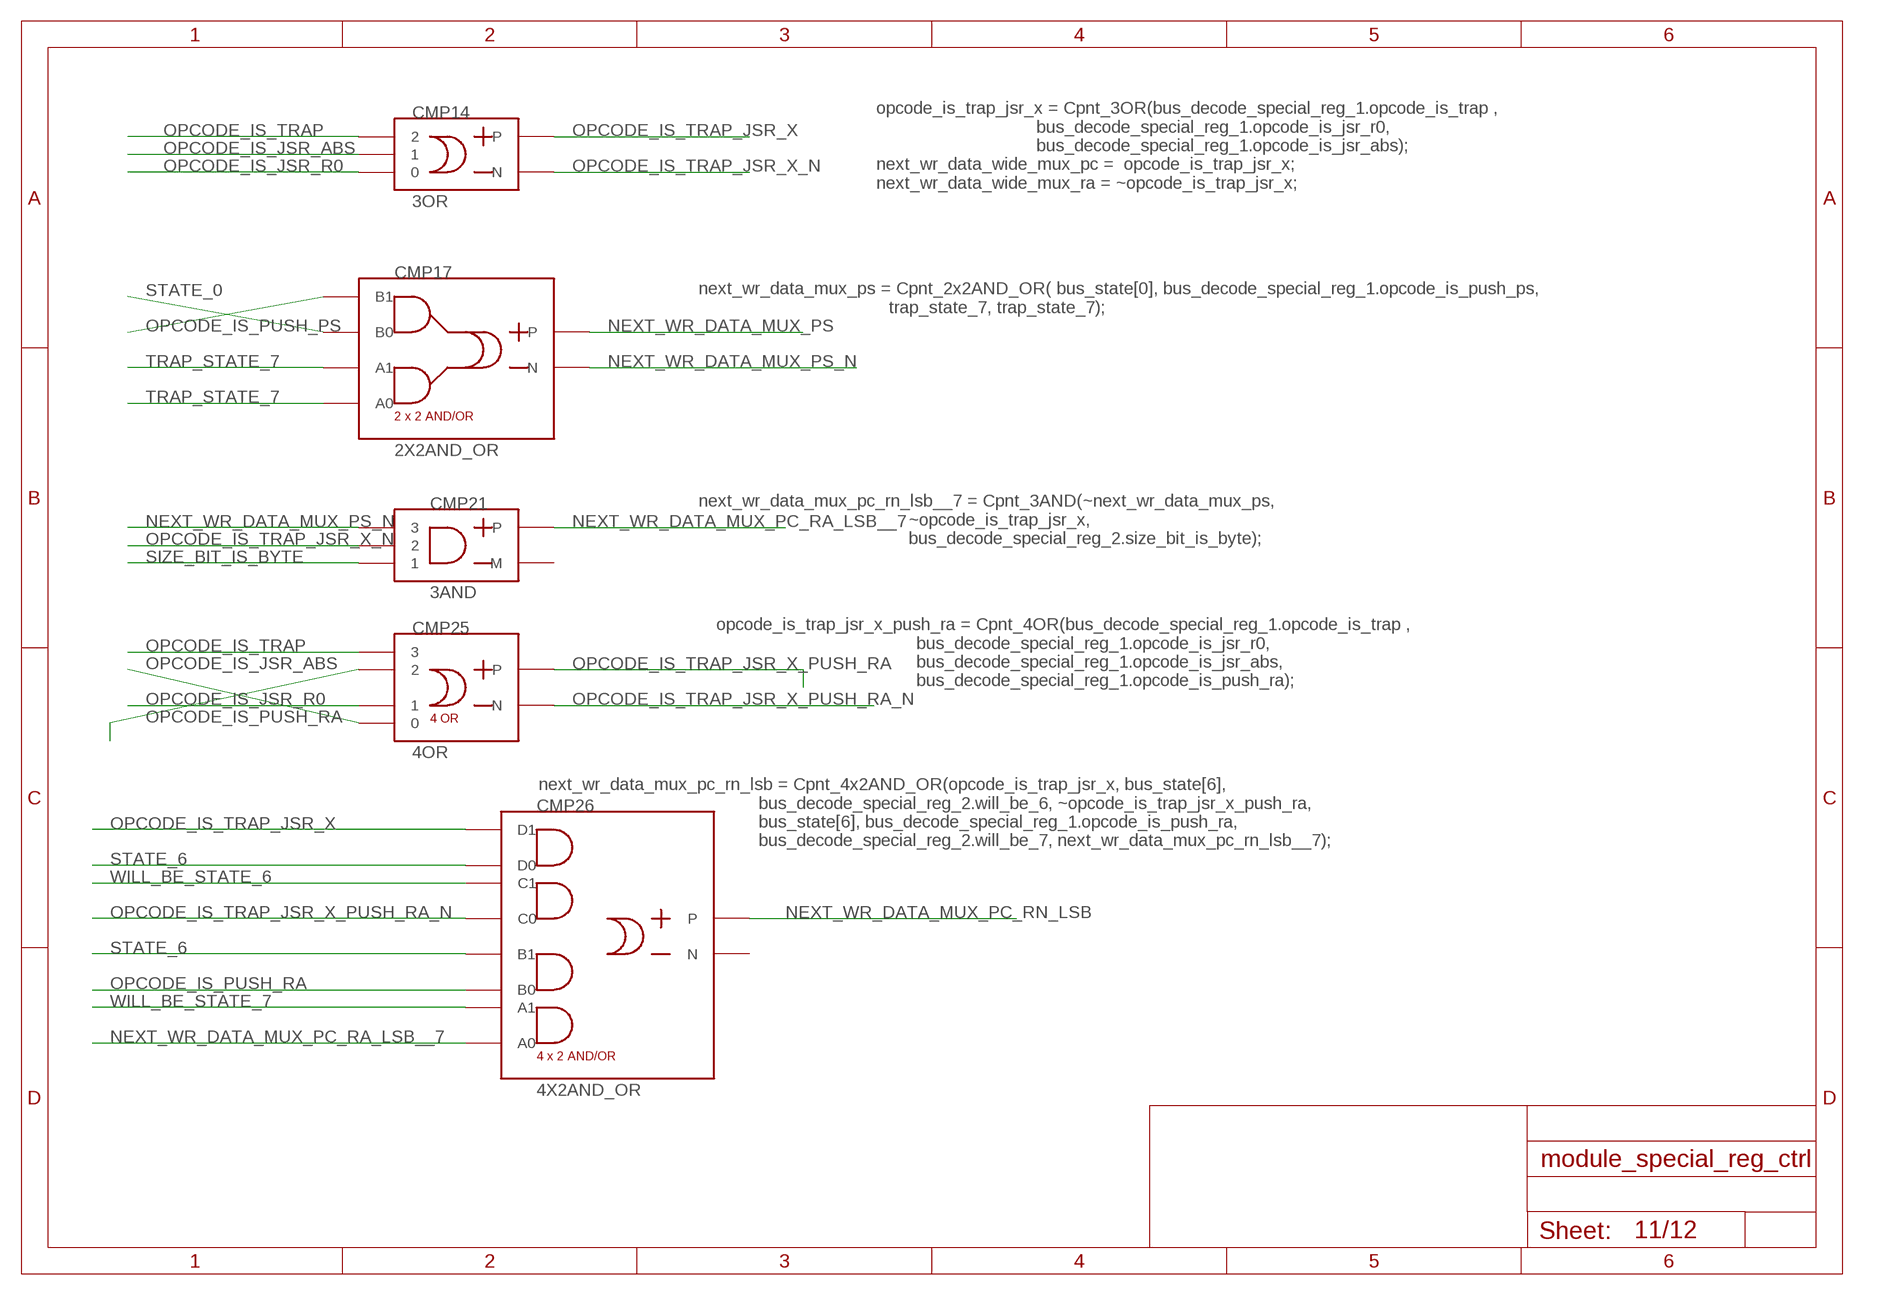
[diagram p10: schematic, sheet 11]

### Parts
CMP14  3OR  [3OR]
CMP17  2X2AND_OR  [2X2AND_OR]
CMP21  3AND  [3AND]
CMP25  4OR  [4OR]
CMP26  4X2AND_OR  [4X2AND_OR]

### Nets
NEXT_WR_DATA_MUX_PC_RA_LSB__7: CMP21.OUT_P(P) CMP26.P$1(A0)
NEXT_WR_DATA_MUX_PC_RN_LSB: CMP26.OUT_P(P) ; also sheet 3
NEXT_WR_DATA_MUX_PS: CMP17.OUT_P(P) ; also sheet 3,12
NEXT_WR_DATA_MUX_PS_N: CMP17.OUT_M(N) CMP21.P$3
OPCODE_IS_JSR_ABS: CMP14.P$2 CMP25.1 ; also sheet 2,5,8
OPCODE_IS_JSR_R0: CMP14.P$1 CMP25.2 ; also sheet 2,7,9
OPCODE_IS_PUSH_PS: CMP17.P$4(B1) ; also sheet 2,7,9,10
OPCODE_IS_PUSH_RA: CMP25.3 CMP26.P$3(B0) ; also sheet 2,7,9,10,12
OPCODE_IS_TRAP: CMP14.P$3 CMP25.4 ; also sheet 2,4,9
OPCODE_IS_TRAP_JSR_X: CMP14.OUT_P(P) CMP26.P$8(D1) ; also sheet 3,12
OPCODE_IS_TRAP_JSR_X_N: CMP14.OUT_M(N) CMP21.P$2 ; also sheet 3
OPCODE_IS_TRAP_JSR_X_PUSH_RA: CMP25.OUT_P(P)
OPCODE_IS_TRAP_JSR_X_PUSH_RA_N: CMP25.OUT_M(N) CMP26.P$5(C0)
SIZE_BIT_IS_BYTE: CMP21.P$1 ; also sheet 2,12
STATE_0: CMP17.P$3(B0) ; also sheet 1,4,5,6,7,8,9,10,12
STATE_6: CMP26.P$4(B1) CMP26.P$7(D0) ; also sheet 1,4,9,12
TRAP_STATE_7: CMP17.P$1(A0) CMP17.P$2(A1) ; also sheet 4,7,8,9
WILL_BE_STATE_6: CMP26.P$6(C1) ; also sheet 2
WILL_BE_STATE_7: CMP26.P$2(A1) ; also sheet 2,12
Unconnected: CMP21.OUT_M(M) CMP26.OUT_M(N)

### Notes on the sheet
- opcode_is_trap_jsr_x = Cpnt_3OR(bus_decode_special_reg_1.opcode_is_trap ,
                                      bus_decode_special_reg_1.opcode_is_jsr_r0,
                                      bus_decode_special_reg_1.opcode_is_jsr_abs);
      next_wr_data_wide_mux_pc =  opcode_is_trap_jsr_x;
      next_wr_data_wide_mux_ra = ~opcode_is_trap_jsr_x;
- next_wr_data_mux_ps = Cpnt_2x2AND_OR( bus_state[0], bus_decode_special_reg_1.opcode_is_push_ps,
                                            trap_state_7, trap_state_7);
- next_wr_data_mux_pc_rn_lsb__7 = Cpnt_3AND(~next_wr_data_mux_ps,
                                                ~opcode_is_trap_jsr_x,
                                                bus_decode_special_reg_2.size_bit_is_byte);
- opcode_is_trap_jsr_x_push_ra = Cpnt_4OR(bus_decode_special_reg_1.opcode_is_trap ,
                                              bus_decode_special_reg_1.opcode_is_jsr_r0,
                                              bus_decode_special_reg_1.opcode_is_jsr_abs,
                                              bus_decode_special_reg_1.opcode_is_push_ra);
- next_wr_data_mux_pc_rn_lsb = Cpnt_4x2AND_OR(opcode_is_trap_jsr_x, bus_state[6],
                                                  bus_decode_special_reg_2.will_be_6, ~opcode_is_trap_jsr_x_push_ra,
                                                  bus_state[6], bus_decode_special_reg_1.opcode_is_push_ra,
                                                  bus_decode_special_reg_2.will_be_7, next_wr_data_mux_pc_rn_lsb__7);

## Sheet 12 of 12
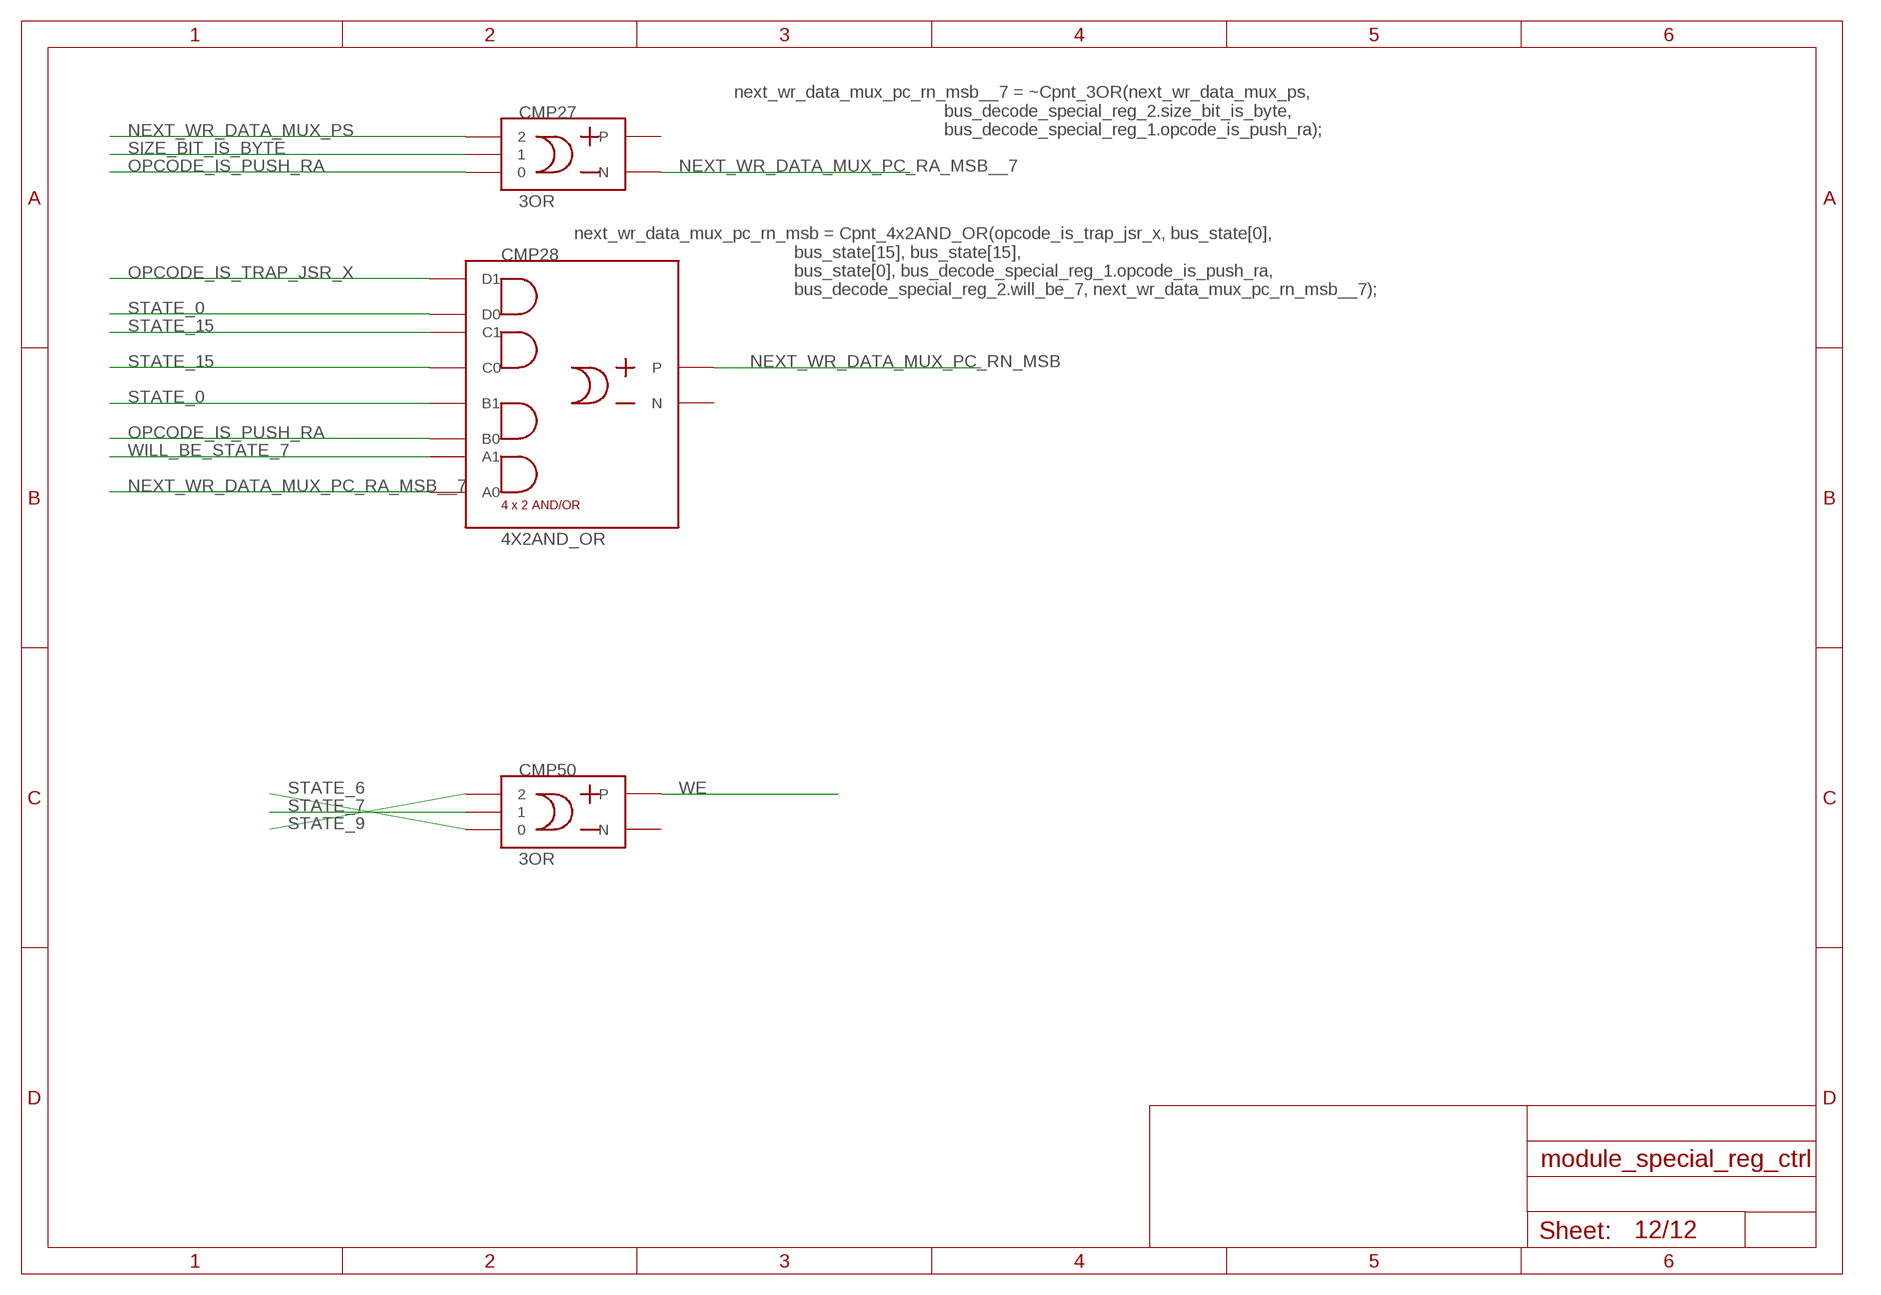
[diagram p11: schematic, sheet 12]

### Parts
CMP27  3OR  [3OR]
CMP28  4X2AND_OR  [4X2AND_OR]
CMP50  3OR  [3OR]

### Nets
NEXT_WR_DATA_MUX_PC_RA_MSB__7: CMP27.OUT_M(N) CMP28.P$1(A0)
NEXT_WR_DATA_MUX_PC_RN_MSB: CMP28.OUT_P(P) ; also sheet 3
NEXT_WR_DATA_MUX_PS: CMP27.P$3 ; also sheet 3,11
OPCODE_IS_PUSH_RA: CMP27.P$1 CMP28.P$3(B0) ; also sheet 2,7,9,10,11
OPCODE_IS_TRAP_JSR_X: CMP28.P$8(D1) ; also sheet 3,11
SIZE_BIT_IS_BYTE: CMP27.P$2 ; also sheet 2,11
STATE_0: CMP28.P$4(B1) CMP28.P$7(D0) ; also sheet 1,4,5,6,7,8,9,10,11
STATE_6: CMP50.P$1 ; also sheet 1,4,9,11
STATE_7: CMP50.P$2 ; also sheet 1,4
STATE_9: CMP50.P$3 ; also sheet 1
STATE_15: CMP28.P$5(C0) CMP28.P$6(C1) ; also sheet 1,7,9
WE: CMP50.OUT_P(P)
WILL_BE_STATE_7: CMP28.P$2(A1) ; also sheet 2,11
Unconnected: CMP27.OUT_P(P) CMP28.OUT_M(N) CMP50.OUT_M(N)

### Notes on the sheet
- next_wr_data_mux_pc_rn_msb__7 = ~Cpnt_3OR(next_wr_data_mux_ps,
                                                bus_decode_special_reg_2.size_bit_is_byte,
                                                bus_decode_special_reg_1.opcode_is_push_ra);
- next_wr_data_mux_pc_rn_msb = Cpnt_4x2AND_OR(opcode_is_trap_jsr_x, bus_state[0], 
                                                  bus_state[15], bus_state[15],
                                                  bus_state[0], bus_decode_special_reg_1.opcode_is_push_ra,
                                                  bus_decode_special_reg_2.will_be_7, next_wr_data_mux_pc_rn_msb__7);

## Library data of the parts
CMP1 CMP14 CMP27 CMP36 CMP50 CMP54 CMP61 = modules:3OR
CMP2 CMP8 CMP12 CMP43 CMP57 = modules:2OR
CMP3 CMP31 CMP56 = modules:BUS_CONSTRUCT_DISPLAY
CMP4 CMP6 CMP7 CMP22 CMP62 = modules:1BUF
CMP5 CMP9 CMP25 CMP30 CMP38 CMP40 CMP47 CMP49 = modules:4OR
CMP10 CMP26 CMP28 CMP42 = modules:4X2AND_OR
CMP11 CMP29 CMP41 CMP58 = modules:5OR
CMP13 CMP18 CMP19 CMP23 CMP24 = modules:BUS_SPLIT_DISPLAY
CMP15 CMP21 CMP35 CMP59 CMP60 = modules:3AND
CMP16 CMP33 CMP45 CMP48 CMP53 CMP67 = modules:2AND
CMP17 CMP20 CMP34 CMP37 CMP39 CMP44 CMP46 CMP52 = modules:2X2AND_OR
CMP32 = modules:4AND